# Altium project IntelligentJunctionBox_V1.PrjPcb
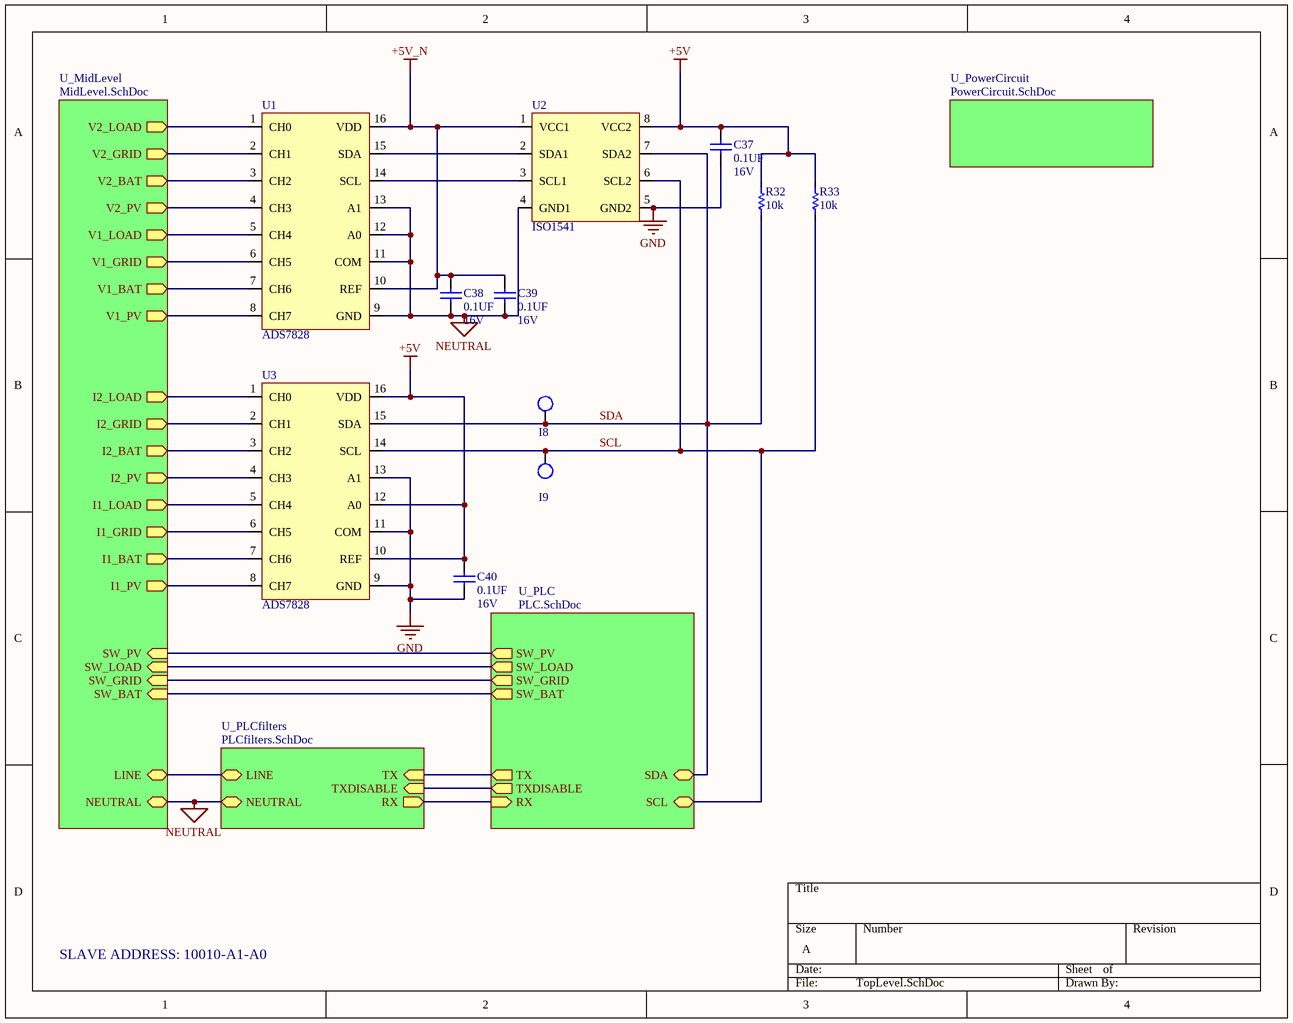
[diagram p0: TopLevel.SchDoc]
8 sheets, 283 parts. Net scope: hierarchical (ports join the sheet entries above them; power ports are global).
Board file: IntelligentJunctionBox_V1.PcbDoc
Sheets:
  TopLevel.SchDoc
    U_MidLevel = MidLevel.SchDoc
      PV1 = Isense.SchDoc
      B1 = Isense.SchDoc
      LD1 = Isense.SchDoc
      G1 = Isense.SchDoc
      LD2 = SSR.SchDoc
      PV2 = SSR.SchDoc
      B2 = SSR.SchDoc
      G2 = SSR.SchDoc
      PV3 = Vsense.SchDoc
      G3 = Vsense.SchDoc
      B3 = Vsense.SchDoc
      LD3 = Vsense.SchDoc
    U_PLCfilters = PLCfilters.SchDoc
    U_PLC = PLC.SchDoc
    U_PowerCircuit = PowerCircuit.SchDoc

## Sheet TopLevel.SchDoc
size A

### Parts
C37  Capacitance: 0.1UF  Voltage - Rated: 16V  [CAPC1608X08N]  (hidden comment: GRM188R71C104KA01D)
C38  Capacitance: 0.1UF  Voltage - Rated: 16V  [CAPC1608X08N]  (hidden comment: GRM188R71C104KA01D)
C39  Capacitance: 0.1UF  Voltage - Rated: 16V  [CAPC1608X08N]  (hidden comment: GRM188R71C104KA01D)
C40  Capacitance: 0.1UF  Voltage - Rated: 16V  [CAPC1608X08N]  (hidden comment: GRM188R71C104KA01D)
I8  Testpoint  [Testpoint]  (value not drawn)
I9  Testpoint  [Testpoint]  (value not drawn)
R32  Resistance: 10k  [RESC1608X06N]  (hidden comment: RC0603FR-0710KL)
R33  Resistance: 10k  [RESC1608X06N]  (hidden comment: RC0603FR-0710KL)
U1  ADS7828  [TSOP65P640X120-16N]
U2  ISO1541  [SOIC127P600X175-8N]
U3  ADS7828  [TSOP65P640X120-16N]

### Sub-sheets
U_MidLevel = MidLevel.SchDoc: V1_PV (out), V2_PV (out), I1_PV (out), I2_PV (out), SW_PV (in), V1_LOAD (out), V2_LOAD (out), I1_LOAD (out), I2_LOAD (out), SW_LOAD (in), V1_GRID (out), V2_GRID (out), I1_GRID (out), I2_GRID (out), SW_GRID (in), V1_BAT (out), V2_BAT (out), I1_BAT (out), I2_BAT (out), SW_BAT (in), NEUTRAL (bidir), LINE (bidir)
U_PLC = PLC.SchDoc: TX (out), RX (in), TXDISABLE (out), SCL (bidir), SDA (bidir), SW_PV (out), SW_LOAD (out), SW_GRID (out), SW_BAT (out)
U_PLCfilters = PLCfilters.SchDoc: RX (out), TX (in), TXDISABLE (in), LINE (bidir), NEUTRAL (bidir)
U_PowerCircuit = PowerCircuit.SchDoc: no entries

### Nets
+5V: C37.2 C40.2 R32.2 R33.2 U2.8(VCC2) U3.10(REF) U3.12(A0) U3.16(VDD)
+5V_N: C38.2 C39.2 U1.10(REF) U1.16(VDD) U2.1(VCC1)
GND: C37.1 C40.1 U2.5(GND2) U3.9(GND) U3.11(COM) U3.13(A1)
NEUTRAL: C38.1 C39.1 U1.9(GND) U1.11(COM) U1.12(A0) U1.13(A1) U2.4(GND1) ; sheet U_MidLevel/NEUTRAL, sheet U_PLCfilters/NEUTRAL
I1_BAT: U3.7(CH6) ; sheet U_MidLevel/I1_BAT
I1_GD: U3.6(CH5) ; sheet U_MidLevel/I1_GRID
I1_LD: U3.5(CH4) ; sheet U_MidLevel/I1_LOAD
I1_PV: U3.8(CH7) ; sheet U_MidLevel/I1_PV
I2_BAT: U3.3(CH2) ; sheet U_MidLevel/I2_BAT
I2_GD: U3.2(CH1) ; sheet U_MidLevel/I2_GRID
I2_LD: U3.1(CH0) ; sheet U_MidLevel/I2_LOAD
I2_PV: U3.4(CH3) ; sheet U_MidLevel/I2_PV
L1_BUS: sheet U_MidLevel/LINE, sheet U_PLCfilters/LINE
RX: sheet U_PLCfilters/RX, sheet U_PLC/RX
SCL: I9.1(TP) R33.1 U2.6(SCL2) U3.14(SCL) ; sheet U_PLC/SCL
SDA: I8.1(TP) R32.1 U2.7(SDA2) U3.15(SDA) ; sheet U_PLC/SDA
SW_BAT: sheet U_MidLevel/SW_BAT, sheet U_PLC/SW_BAT
SW_GD: sheet U_MidLevel/SW_GRID, sheet U_PLC/SW_GRID
SW_LD: sheet U_MidLevel/SW_LOAD, sheet U_PLC/SW_LOAD
SW_PV: sheet U_MidLevel/SW_PV, sheet U_PLC/SW_PV
TX: sheet U_PLCfilters/TX, sheet U_PLC/TX
TXDISABLE: sheet U_PLCfilters/TXDISABLE, sheet U_PLC/TXDISABLE
V1_BAT: U1.7(CH6) ; sheet U_MidLevel/V1_BAT
V1_GD: U1.6(CH5) ; sheet U_MidLevel/V1_GRID
V1_LD: U1.5(CH4) ; sheet U_MidLevel/V1_LOAD
V1_PV: U1.8(CH7) ; sheet U_MidLevel/V1_PV
V2_BAT: U1.3(CH2) ; sheet U_MidLevel/V2_BAT
V2_GD: U1.2(CH1) ; sheet U_MidLevel/V2_GRID
V2_LD: U1.1(CH0) ; sheet U_MidLevel/V2_LOAD
V2_PV: U1.4(CH3) ; sheet U_MidLevel/V2_PV
NetU1_14: U1.14(SCL) U2.3(SCL1)
NetU1_15: U1.15(SDA) U2.2(SDA1)

### Notes on the sheet
- SLAVE ADDRESS: 10010-A1-A0

### Library data of the parts
C37-C40 = GRM188R71C104KA01D: CAP CER 0.1UF 16V X7R 0603; Manufacturer: Murata Electronics North America; Manufacturer Part Number: GRM188R71C104KA01D; Supplier 1: Digi-Key; Supplier Part Number 1: 490-1532-1-ND
R32 R33 = RC0603FR-0710KL: RES SMD 10K OHM 1% 1/10W 0603; Manufacturer: Yageo; Manufacturer Part Number: RC0603FR-0710KL; Supplier 1: Digi-Key; Supplier Part Number 1: 311-10.0KHRCT-ND
U1 U3 = ADS7828: IC ADC 12BIT 50KSPS 8CH 16-TSSOP; Manufacturer: Texas Instruments; Manufacturer Part Number: ADS7828; Supplier 1: Digi-Key; Supplier Part Number 1: 296-38856-1-ND
U2 = ISO1541: DGTL ISO 2.5KV 2CH I2C 8SOIC; Manufacturer: Texas Instruments; Manufacturer Part Number: ISO1541; Supplier 1: Digi-Key; Supplier Part Number 1: 296-34895-5-ND

## Sheet MidLevel.SchDoc
size Letter
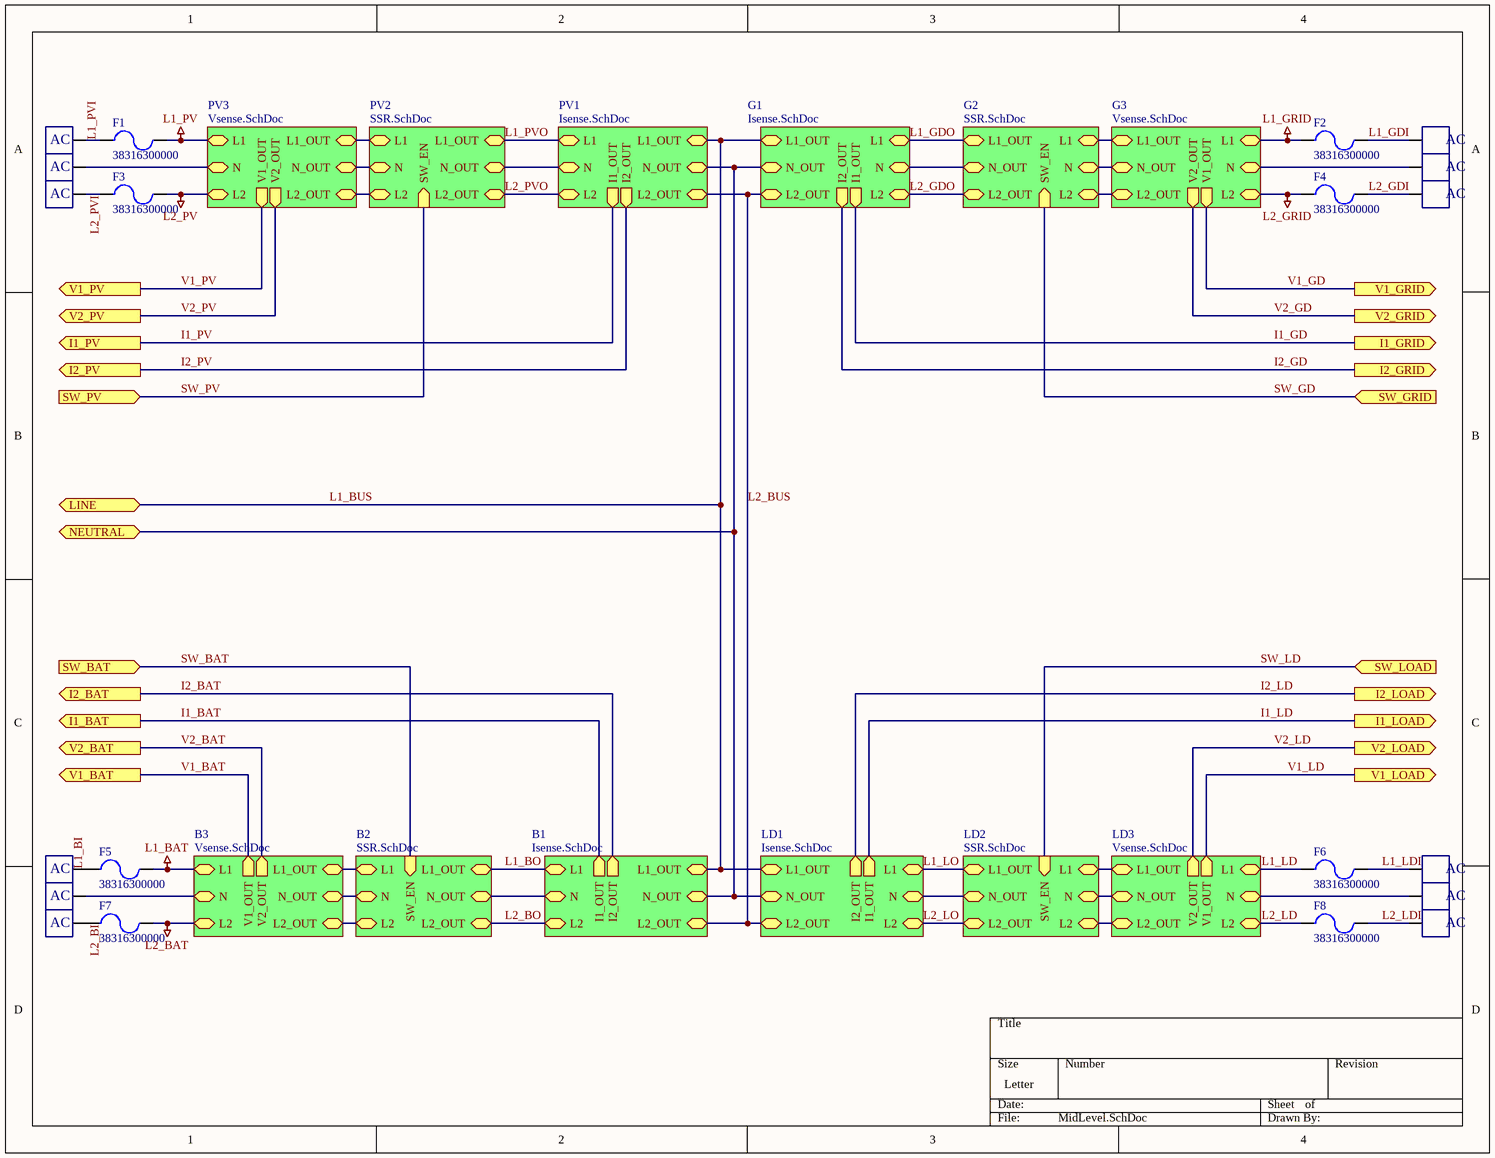
[diagram p1: MidLevel.SchDoc]

### Parts
F1  38316300000  [38316300000]
F2  38316300000  [38316300000]
F3  38316300000  [38316300000]
F4  38316300000  [38316300000]
F5  38316300000  [38316300000]
F6  38316300000  [38316300000]
F7  38316300000  [38316300000]
F8  38316300000  [38316300000]
J2  AC Connector_1  [AC_Connector_1]  (value not drawn)
J3  AC Connector_1  [AC_Connector_1]  (value not drawn)
J4  AC Connector_1  [AC_Connector_1]  (value not drawn)
J5  AC Connector_1  [AC_Connector_1]  (value not drawn)
J6  AC Connector_1  [AC_Connector_1]  (value not drawn)
J7  AC Connector_1  [AC_Connector_1]  (value not drawn)
J8  AC Connector_1  [AC_Connector_1]  (value not drawn)
J9  AC Connector_1  [AC_Connector_1]  (value not drawn)
J10  AC Connector_1  [AC_Connector_1]  (value not drawn)
J11  AC Connector_1  [AC_Connector_1]  (value not drawn)
J12  AC Connector_1  [AC_Connector_1]  (value not drawn)
J13  AC Connector_1  [AC_Connector_1]  (value not drawn)

### Sub-sheets
B1 = Isense.SchDoc: L1_OUT (bidir), L2_OUT (bidir), N_OUT (bidir), I1_OUT (out), I2_OUT (out), L1 (bidir), N (bidir), L2 (bidir)
B2 = SSR.SchDoc: SW_EN (in), L2_OUT (bidir), L2 (bidir), L1 (bidir), L1_OUT (bidir), N_OUT (bidir), N (bidir)
B3 = Vsense.SchDoc: L1 (bidir), L1_OUT (bidir), N (bidir), L2 (bidir), L2_OUT (bidir), N_OUT (bidir), V1_OUT (out), V2_OUT (out)
G1 = Isense.SchDoc: L1_OUT (bidir), L2_OUT (bidir), N_OUT (bidir), I1_OUT (out), I2_OUT (out), L1 (bidir), N (bidir), L2 (bidir)
G2 = SSR.SchDoc: SW_EN (in), N_OUT (bidir), L1_OUT (bidir), L2 (bidir), N (bidir), L1 (bidir), L2_OUT (bidir)
G3 = Vsense.SchDoc: L1 (bidir), L1_OUT (bidir), N (bidir), L2 (bidir), L2_OUT (bidir), N_OUT (bidir), V1_OUT (out), V2_OUT (out)
LD1 = Isense.SchDoc: L1_OUT (bidir), L2_OUT (bidir), N_OUT (bidir), I1_OUT (out), I2_OUT (out), L1 (bidir), N (bidir), L2 (bidir)
LD2 = SSR.SchDoc: SW_EN (in), L1_OUT (bidir), L2 (bidir), L2_OUT (bidir), L1 (bidir), N (bidir), N_OUT (bidir)
LD3 = Vsense.SchDoc: L1 (bidir), L1_OUT (bidir), N (bidir), L2 (bidir), L2_OUT (bidir), N_OUT (bidir), V1_OUT (out), V2_OUT (out)
PV1 = Isense.SchDoc: L1_OUT (bidir), L2_OUT (bidir), N_OUT (bidir), I1_OUT (out), I2_OUT (out), L1 (bidir), N (bidir), L2 (bidir)
PV2 = SSR.SchDoc: SW_EN (in), L2_OUT (bidir), N (bidir), N_OUT (bidir), L1 (bidir), L1_OUT (bidir), L2 (bidir)
PV3 = Vsense.SchDoc: L1 (bidir), L1_OUT (bidir), N (bidir), L2 (bidir), L2_OUT (bidir), N_OUT (bidir), V1_OUT (out), V2_OUT (out)

### Ports
I1_BAT (out), I1_GRID (out), I1_LOAD (out), I1_PV (out), I2_BAT (out), I2_GRID (out), I2_LOAD (out), I2_PV (out), LINE (bidir), NEUTRAL (bidir), SW_BAT (in), SW_GRID (in), SW_LOAD (in), SW_PV (in), V1_BAT (out), V1_GRID (out), V1_LOAD (out), V1_PV (out), V2_BAT (out), V2_GRID (out), V2_LOAD (out), V2_PV (out)

### Nets
L1_BAT: F5.2 ; sheet B2/L1, sheet B3/L1, sheet B3/L1_OUT
L1_GRID: F2.1 ; sheet G2/L1, sheet G3/L1, sheet G3/L1_OUT
L1_PV: F1.2 ; sheet PV2/L1, sheet PV3/L1, sheet PV3/L1_OUT
L2_BAT: F7.2 ; sheet B2/L2, sheet B3/L2, sheet B3/L2_OUT
L2_GRID: F4.1 ; sheet G2/L2, sheet G3/L2, sheet G3/L2_OUT
L2_PV: F3.2 ; sheet PV2/L2, sheet PV3/L2, sheet PV3/L2_OUT
NEUTRAL: J4.1 J5.1 J10.1 J11.1 ; port NEUTRAL, sheet PV1/N_OUT, sheet PV1/N, sheet B1/N_OUT, sheet B1/N, sheet LD1/N_OUT, sheet LD1/N, sheet G1/N_OUT, sheet G1/N, sheet LD2/N, sheet LD2/N_OUT, sheet PV2/N, sheet PV2/N_OUT, sheet B2/N_OUT, sheet B2/N, sheet G2/N_OUT, sheet G2/N, sheet PV3/N, sheet PV3/N_OUT, sheet G3/N, sheet G3/N_OUT, sheet B3/N, sheet B3/N_OUT, sheet LD3/N, sheet LD3/N_OUT
I1_BAT: port I1_BAT, sheet B1/I1_OUT
I1_GD: port I1_GRID, sheet G1/I1_OUT
I1_LD: port I1_LOAD, sheet LD1/I1_OUT
I1_PV: port I1_PV, sheet PV1/I1_OUT
I2_BAT: port I2_BAT, sheet B1/I2_OUT
I2_GD: port I2_GRID, sheet G1/I2_OUT
I2_LD: port I2_LOAD, sheet LD1/I2_OUT
I2_PV: port I2_PV, sheet PV1/I2_OUT
L1_BI: F5.1 J8.1
L1_BO: sheet B1/L1, sheet B2/L1_OUT
L1_BUS: port LINE, sheet PV1/L1_OUT, sheet B1/L1_OUT, sheet LD1/L1_OUT, sheet G1/L1_OUT
L1_GDI: F2.2 J3.1
L1_GDO: sheet G1/L1, sheet G2/L1_OUT
L1_LD: F6.1 ; sheet LD2/L1, sheet LD3/L1, sheet LD3/L1_OUT
L1_LDI: F6.2 J9.1
L1_LO: sheet LD1/L1, sheet LD2/L1_OUT
L1_PVI: F1.1 J2.1
L1_PVO: sheet PV1/L1, sheet PV2/L1_OUT
L2_BI: F7.1 J12.1
L2_BO: sheet B1/L2, sheet B2/L2_OUT
L2_BUS: sheet PV1/L2_OUT, sheet B1/L2_OUT, sheet LD1/L2_OUT, sheet G1/L2_OUT
L2_GDI: F4.2 J7.1
L2_GDO: sheet G1/L2, sheet G2/L2_OUT
L2_LD: F8.1 ; sheet LD2/L2, sheet LD3/L2, sheet LD3/L2_OUT
L2_LDI: F8.2 J13.1
L2_LO: sheet LD1/L2, sheet LD2/L2_OUT
L2_PVI: F3.1 J6.1
L2_PVO: sheet PV1/L2, sheet PV2/L2_OUT
SW_BAT: port SW_BAT, sheet B2/SW_EN
SW_GD: port SW_GRID, sheet G2/SW_EN
SW_LD: port SW_LOAD, sheet LD2/SW_EN
SW_PV: port SW_PV, sheet PV2/SW_EN
V1_BAT: port V1_BAT, sheet B3/V1_OUT
V1_GD: port V1_GRID, sheet G3/V1_OUT
V1_LD: port V1_LOAD, sheet LD3/V1_OUT
V1_PV: port V1_PV, sheet PV3/V1_OUT
V2_BAT: port V2_BAT, sheet B3/V2_OUT
V2_GD: port V2_GRID, sheet G3/V2_OUT
V2_LD: port V2_LOAD, sheet LD3/V2_OUT
V2_PV: port V2_PV, sheet PV3/V2_OUT

### Notes on the sheet
- (in symbol AC Connector_1) AC

### Library data of the parts
F1-F8 = 38316300000: FUSE BOARD MOUNT 6.3A 300VAC RAD; Manufacturer: Littelfuse Inc.; Manufacturer Part Number: 38316300000; Supplier 1: Digi-Key; Supplier Part Number 1: WK6301CT-ND
J2-J13 = AC Connector_1: AC Connector

## Sheet Isense.SchDoc
size A
Used 4 times, as channels U_MidLevel/PV1, U_MidLevel/B1, U_MidLevel/LD1, U_MidLevel/G1. Parts and nets are listed once, with the designators drawn on the sheet.
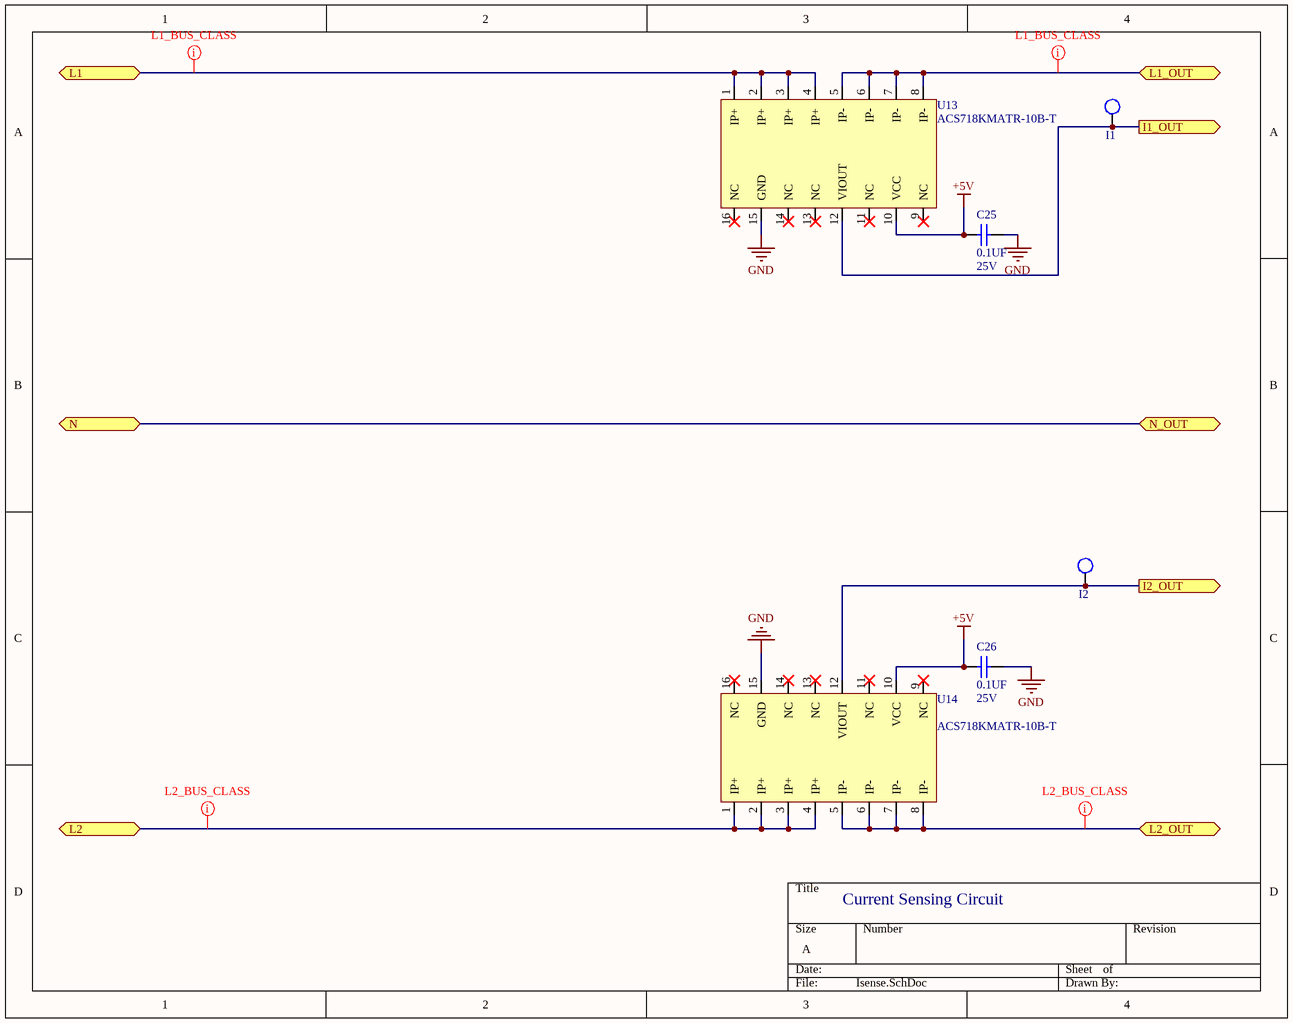
[diagram p2: Isense.SchDoc]

### Parts
C25  Capacitance: 0.1UF  Voltage - Rated: 25V  [CAPC3216X16N]  (hidden comment: GRM319R71E104KA01J)
C26  Capacitance: 0.1UF  Voltage - Rated: 25V  [CAPC3216X16N]  (hidden comment: GRM319R71E104KA01J)
I1  Testpoint  [Testpoint]  (value not drawn)
I2  Testpoint  [Testpoint]  (value not drawn)
U13  ACS718KMATR-10B-T  [SOIC127P1030X265-16N]
U14  ACS718KMATR-10B-T  [SOIC127P1030X265-16N]

### Ports
I1_OUT (out), I2_OUT (out), L1 (bidir), L1_OUT (bidir), L2 (bidir), L2_OUT (bidir), N (bidir), N_OUT (bidir)

### Nets
+5V: C25.1 C26.1 U13.10(VCC) U14.10(VCC)
GND: C25.2 C26.2 U13.15(GND) U14.15(GND)
I1_OUT: I1.1(TP) U13.12(VIOUT) ; port I1_OUT
I2_OUT: I2.1(TP) U14.12(VIOUT) ; port I2_OUT
L1: U13.1(IP+) U13.2(IP+) U13.3(IP+) U13.4(IP+) ; port L1
L1_OUT: U13.5(IP-) U13.6(IP-) U13.7(IP-) U13.8(IP-) ; port L1_OUT
L2: U14.1(IP+) U14.2(IP+) U14.3(IP+) U14.4(IP+) ; port L2
L2_OUT: U14.5(IP-) U14.6(IP-) U14.7(IP-) U14.8(IP-) ; port L2_OUT
N: port N, port N_OUT

Not connected (* = marked no-connect by the designer): U13 9(NC)* 11(NC)* 13(NC)* 14(NC)* 16(NC)*; U14 9(NC)* 11(NC)* 13(NC)* 14(NC)* 16(NC)*

### Channels
U_MidLevel/PV1: designators end in _PV1; ports I1_OUT=I1_PV I2_OUT=I2_PV L1=L1_PVO L1_OUT=L1_BUS L2=L2_PVO L2_OUT=L2_BUS N=NEUTRAL N_OUT=NEUTRAL
U_MidLevel/B1: designators end in _B1; ports I1_OUT=I1_BAT I2_OUT=I2_BAT L1=L1_BO L1_OUT=L1_BUS L2=L2_BO L2_OUT=L2_BUS N=NEUTRAL N_OUT=NEUTRAL
U_MidLevel/LD1: designators end in _LD1; ports I1_OUT=I1_LD I2_OUT=I2_LD L1=L1_LO L1_OUT=L1_BUS L2=L2_LO L2_OUT=L2_BUS N=NEUTRAL N_OUT=NEUTRAL
U_MidLevel/G1: designators end in _G1; ports I1_OUT=I1_GD I2_OUT=I2_GD L1=L1_GDO L1_OUT=L1_BUS L2=L2_GDO L2_OUT=L2_BUS N=NEUTRAL N_OUT=NEUTRAL

### Layout directives
net class L1_BUS_NETS: L1_BUS, L1_PVO
net class L2_BUS_NETS: L2_BUS, L2_PVO

### Notes on the sheet
- Current Sensing Circuit

### Library data of the parts
C25 C26 = GRM319R71E104KA01J: CAP CER 0.1UF 25V X7R 1206; Manufacturer: Murata Electronics North America; Manufacturer Part Number: GRM319R71E104KA01J; Supplier 1: Digi-Key; Supplier Part Number 1: 490-12564-1-ND
U13 U14 = ACS718KMATR-10B-T: SENSOR CURRENT HALL 10A AC/DC; Manufacturer: Allegro MicroSystems, LLC; Supplier 1: Digi-Key; Supplier Part Number 1: 620-1713-1-ND; Manufacturer Part Number: ACS718KMATR-10B-T

## Sheet SSR.SchDoc
size A
Used 4 times, as channels U_MidLevel/LD2, U_MidLevel/PV2, U_MidLevel/B2, U_MidLevel/G2. Parts and nets are listed once, with the designators drawn on the sheet.
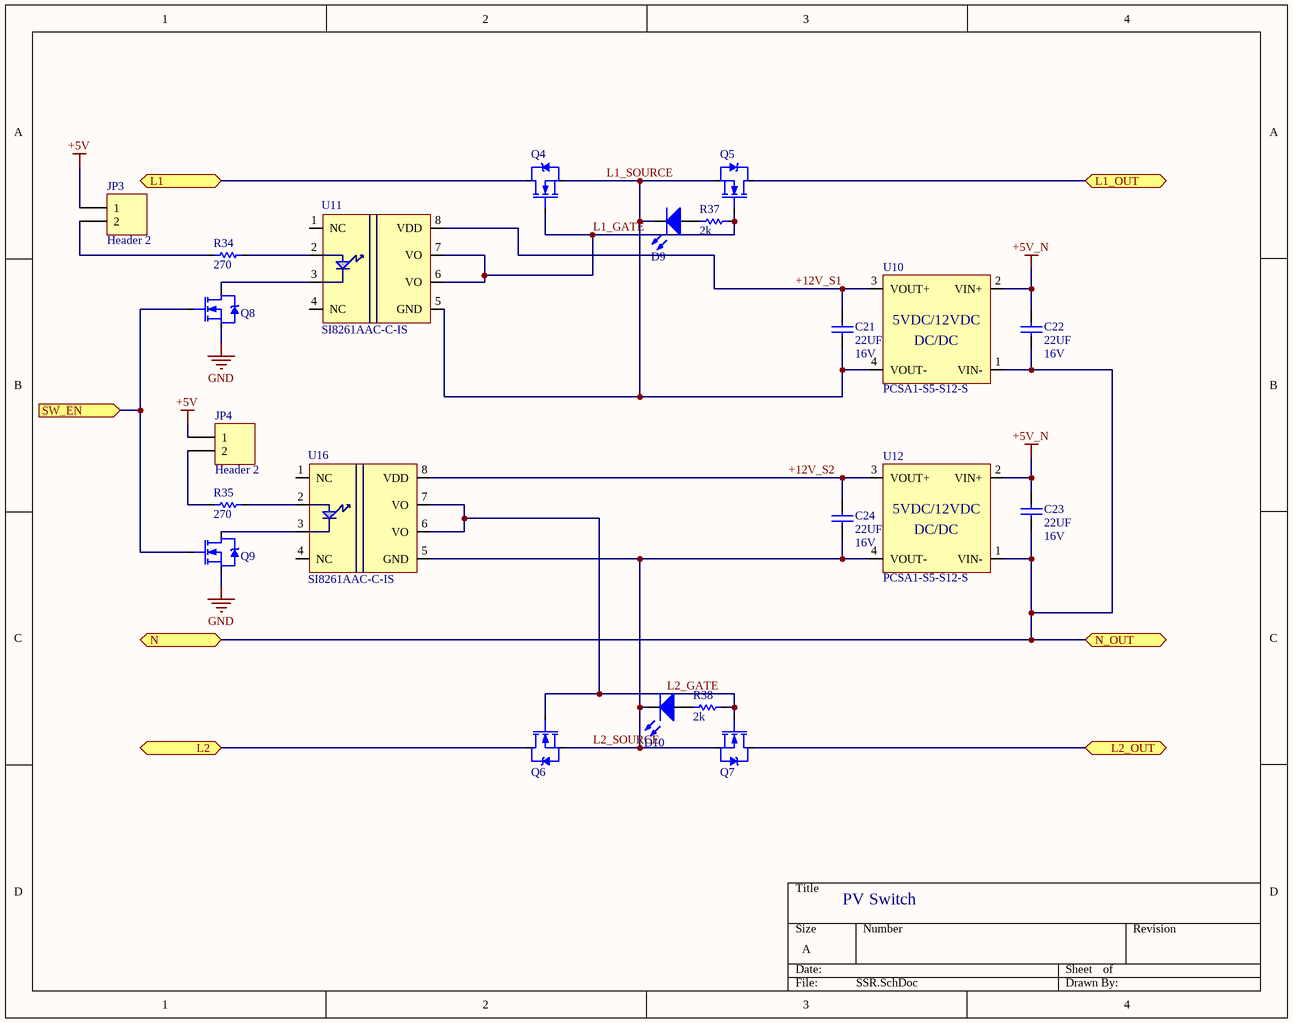
[diagram p3: SSR.SchDoc]

### Parts
C21  Capacitance: 22UF  Voltage - Rated: 16V  [CAPC3216X16N]  (hidden comment: GRM31CR61C226KE15K)
C22  Capacitance: 22UF  Voltage - Rated: 16V  [CAPC3216X16N]  (hidden comment: GRM31CR61C226KE15K)
C23  Capacitance: 22UF  Voltage - Rated: 16V  [CAPC3216X16N]  (hidden comment: GRM31CR61C226KE15K)
C24  Capacitance: 22UF  Voltage - Rated: 16V  [CAPC3216X16N]  (hidden comment: GRM31CR61C226KE15K)
D9  LTST-C190KGKT  [0603 LED]  (value not drawn)
D10  LTST-C190KGKT  [0603 LED]  (value not drawn)
JP3  Header 2  [HDR1X2]
JP4  Header 2  [HDR1X2]
Q4  STB42N60M2-EP  [D2PAK]  (value not drawn)
Q5  STB42N60M2-EP  [D2PAK]  (value not drawn)
Q6  STB42N60M2-EP  [D2PAK]  (value not drawn)
Q7  STB42N60M2-EP  [D2PAK]  (value not drawn)
Q8  NTR5103NT1G  [SOT95P237X111-3N]  (value not drawn)
Q9  NTR5103NT1G  [SOT95P237X111-3N]  (value not drawn)
R34  Resistance: 270  [RESC1608X06N]  (hidden comment: RC0603JR-07270RL)
R35  Resistance: 270  [RESC1608X06N]  (hidden comment: RC0603JR-07270RL)
R37  Resistance: 2k  [RESC1608X06N]  (hidden comment: RC0603FR-072KL)
R38  Resistance: 2k  [RESC1608X06N]  (hidden comment: RC0603FR-072KL)
U10  PCSA1-S5-S12-S  [PCSA1-S5-S12-S]
U11  SI8261AAC-C-IS  [SOIC-8]
U12  PCSA1-S5-S12-S  [PCSA1-S5-S12-S]
U16  SI8261AAC-C-IS  [SOIC-8]

### Ports
L1 (bidir), L1_OUT (bidir), L2 (bidir), L2_OUT (bidir), N (bidir), N_OUT (bidir), SW_EN (in)

### Nets
+5V: JP3.1 JP4.1
+5V_N: C22.2 C23.2 U10.2(VIN+) U12.2(VIN+)
GND: Q8.2(S) Q9.2(S)
+12V_S1: C21.2 U10.3(VOUT+) U11.8(VDD)
+12V_S2: C24.2 U12.3(VOUT+) U16.8(VDD)
L1: Q4.2(D) ; port L1
L1_GATE: Q4.1(G) Q5.1(G) R37.2 U11.6(VO) U11.7(VO)
L1_OUT: Q5.2(D) ; port L1_OUT
L1_SOURCE: C21.1 D9.2(K) Q4.3(S) Q5.3(S) U10.4(VOUT-) U11.5(GND)
L2: Q6.2(D) ; port L2
L2_GATE: Q6.1(G) Q7.1(G) R38.2 U16.6(VO) U16.7(VO)
L2_OUT: Q7.2(D) ; port L2_OUT
L2_SOURCE: C24.1 D10.2(K) Q6.3(S) Q7.3(S) U12.4(VOUT-) U16.5(GND)
N: C22.1 C23.1 U10.1(VIN-) U12.1(VIN-) ; port N, port N_OUT
SW_EN: Q8.1(G) Q9.1(G) ; port SW_EN
NetD9_1: D9.1(A) R37.1
NetD10_1: D10.1(A) R38.1
NetJP3_2: JP3.2 R34.1
NetJP4_2: JP4.2 R35.1
NetQ8_3: Q8.3(D) U11.3(K)
NetQ9_3: Q9.3(D) U16.3(K)
NetR34_2: R34.2 U11.2(A)
NetR35_2: R35.2 U16.2(A)

Not connected (* = marked no-connect by the designer): U11 1(NC) 4(NC); U16 1(NC) 4(NC)

### Channels
U_MidLevel/LD2: designators end in _LD2; ports L1=L1_LD L1_OUT=L1_LO L2=L2_LD L2_OUT=L2_LO N=NEUTRAL N_OUT=NEUTRAL SW_EN=SW_LD
U_MidLevel/PV2: designators end in _PV2; ports L1=L1_PV L1_OUT=L1_PVO L2=L2_PV L2_OUT=L2_PVO N=NEUTRAL N_OUT=NEUTRAL SW_EN=SW_PV
U_MidLevel/B2: designators end in _B2; ports L1=L1_BAT L1_OUT=L1_BO L2=L2_BAT L2_OUT=L2_BO N=NEUTRAL N_OUT=NEUTRAL SW_EN=SW_BAT
U_MidLevel/G2: designators end in _G2; ports L1=L1_GRID L1_OUT=L1_GDO L2=L2_GRID L2_OUT=L2_GDO N=NEUTRAL N_OUT=NEUTRAL SW_EN=SW_GD

### Notes on the sheet
- PV Switch
- (in symbol PCSA1-S5-S12-S) 5VDC/12VDC; DC/DC

### Library data of the parts
C21-C24 = GRM31CR61C226KE15K: CAP CER 22UF 16V X5R 1206; Manufacturer: Murata Electronics North America; Manufacturer Part Number: GRM31CR61C226KE15K; Supplier 1: Digi-Key; Supplier Part Number 1: 490-6512-1-ND
D9 D10 = LTST-C190KGKT: LED GREEN CLEAR 0603 SMD; Manufacturer: Lite-On Inc.; Manufacturer Part Number: LTST-C190KGKT; Supplier 1: Digi-Key; Supplier Part Number 1: 160-1435-1-ND
JP3 JP4 = Header 2: Header, 2-Pin; Manufacturer: Sullins Connector Solutions; Manufacturer Part Number: PBC36SAAN; Supplier 1: Digi-Key; Supplier Part Number 1: S1011E-36-ND
Q4-Q7 = STB42N60M2-EP: MOSFET N-CH 600V 34A EP D2PAK; Manufacturer: STMicroelectronics; Vdss(max): 600V; Manufacturer Part Number: STB42N60M2-EP; Supplier 1: Digi-Key; Supplier Part Number 1: 497-15896-1-ND
Q8 Q9 = NTR5103NT1G: MOSFET N-CH 60V 0.26A SOT23; Manufacturer: ON Semiconductor; Vdss(max): 60V; Manufacturer Part Number: NTR5103NT1G; Supplier 1: Digi-Key; Supplier Part Number 1: NTR5103NT1GOSCT-ND
R34 R35 = RC0603JR-07270RL: RES SMD 270 OHM 5% 1/10W 0603; Manufacturer: Yageo; Manufacturer Part Number: RC0603JR-07270RL; Supplier 1: Digi-Key; Supplier Part Number 1: 311-270GRCT-ND
R37 R38 = RC0603FR-072KL: RES SMD 2K OHM 1% 1/10W 0603; Manufacturer: Yageo; Manufacturer Part Number: RC0603FR-072KL; Supplier 1: Digi-Key; Supplier Part Number 1: 311-2.00KHRCT-ND
U10 U12 = PCSA1-S5-S12-S: DC/DC CONVERTER 5V-12V 1W; Manufacturer: CUI Inc.; Voltage - Input (Min): 4.5V; Voltage - Input (Max): 5.5V; Voltage - Output: 12V; Manufacturer Part Number: PCSA1-S5-S12-S; Power (Watts): 1W; Supplier 1: Digi-Key; Supplier Part Number 1: 102-3947-ND
U11 U16 = SI8261AAC-C-IS: DGTL ISO 3.75KV GATE DRVR 8SOIC; Manufacturer: Silicon Labs; Manufacturer Part Number: SI8261AAC-C-IS; Supplier 1: Digi-Key; Supplier Part Number 1: SI8261AAC-C-IS-ND

## Sheet Vsense.SchDoc
size A
Used 4 times, as channels U_MidLevel/PV3, U_MidLevel/G3, U_MidLevel/B3, U_MidLevel/LD3. Parts and nets are listed once, with the designators drawn on the sheet.
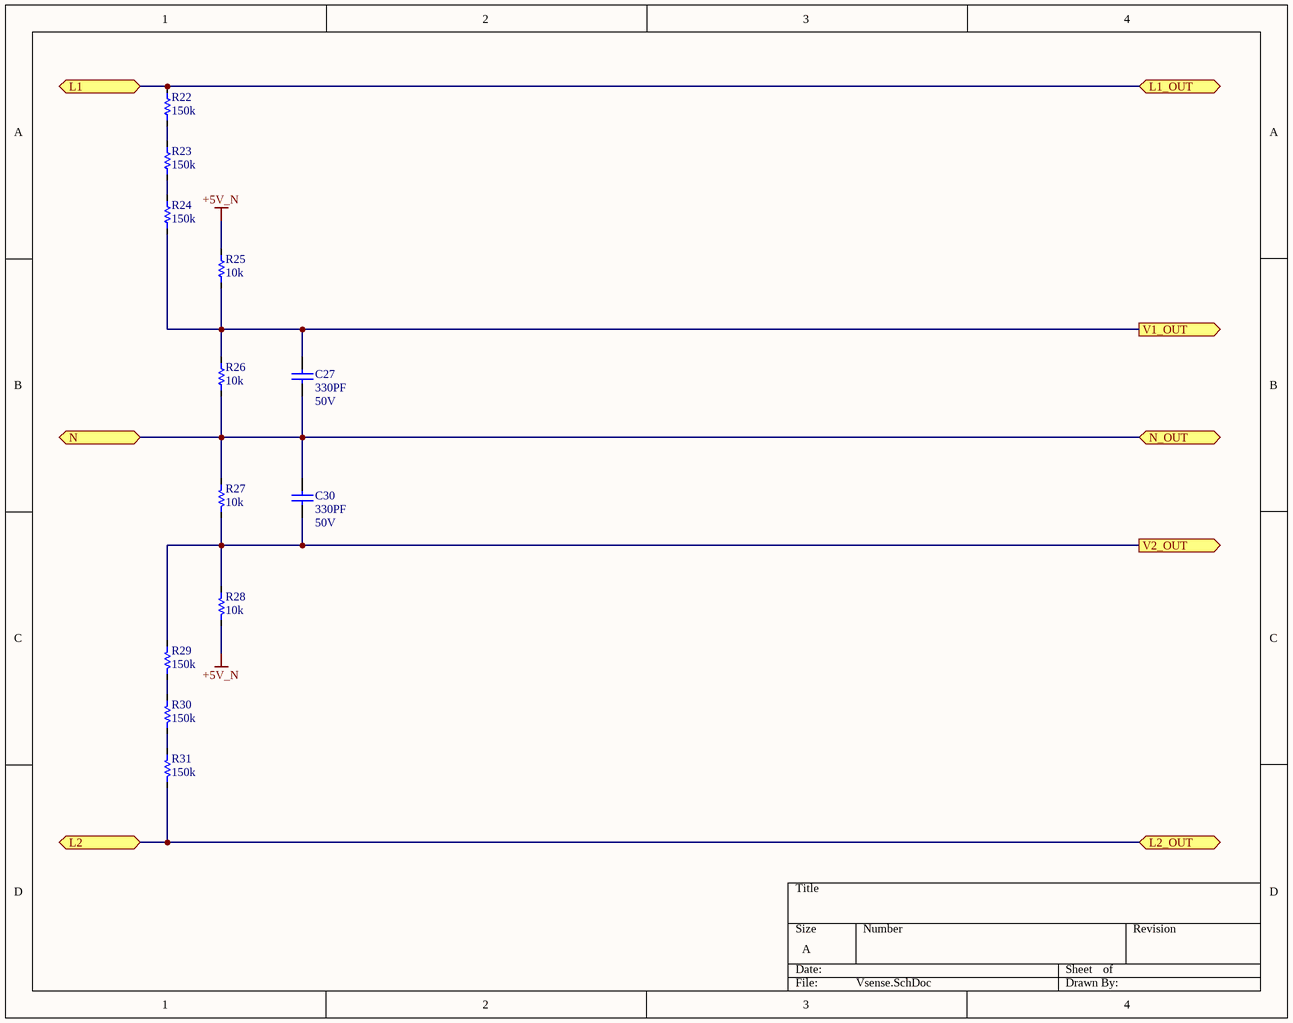
[diagram p4: Vsense.SchDoc]

### Parts
C27  Capacitance: 330PF  Voltage - Rated: 50V  [CAPC1608X08N]  (hidden comment: GRM188R71H331KA01D)
C30  Capacitance: 330PF  Voltage - Rated: 50V  [CAPC1608X08N]  (hidden comment: GRM188R71H331KA01D)
R22  Resistance: 150k  [RESC2012X06N]  (hidden comment: RC0805FR-07150KL)
R23  Resistance: 150k  [RESC2012X06N]  (hidden comment: RC0805FR-07150KL)
R24  Resistance: 150k  [RESC2012X06N]  (hidden comment: RC0805FR-07150KL)
R25  Resistance: 10k  [RESC1608X06N]  (hidden comment: RC0603FR-0710KL)
R26  Resistance: 10k  [RESC1608X06N]  (hidden comment: RC0603FR-0710KL)
R27  Resistance: 10k  [RESC1608X06N]  (hidden comment: RC0603FR-0710KL)
R28  Resistance: 10k  [RESC1608X06N]  (hidden comment: RC0603FR-0710KL)
R29  Resistance: 150k  [RESC2012X06N]  (hidden comment: RC0805FR-07150KL)
R30  Resistance: 150k  [RESC2012X06N]  (hidden comment: RC0805FR-07150KL)
R31  Resistance: 150k  [RESC2012X06N]  (hidden comment: RC0805FR-07150KL)

### Ports
L1 (bidir), L1_OUT (bidir), L2 (bidir), L2_OUT (bidir), N (bidir), N_OUT (bidir), V1_OUT (out), V2_OUT (out)

### Nets
+5V_N: R25.2 R28.2
L1: R22.2 ; port L1, port L1_OUT
L2: R31.2 ; port L2, port L2_OUT
N: C27.1 C30.2 R26.1 R27.1 ; port N, port N_OUT
V1_OUT: C27.2 R24.1 R25.1 R26.2 ; port V1_OUT
V2_OUT: C30.1 R27.2 R28.1 R29.1 ; port V2_OUT
NetR22_1: R22.1 R23.2
NetR23_1: R23.1 R24.2
NetR29_2: R29.2 R30.1
NetR30_2: R30.2 R31.1

### Channels
U_MidLevel/PV3: designators end in _PV3; ports L1=L1_PV L1_OUT=L1_PV L2=L2_PV L2_OUT=L2_PV N=NEUTRAL N_OUT=NEUTRAL V1_OUT=V1_PV V2_OUT=V2_PV
U_MidLevel/G3: designators end in _G3; ports L1=L1_GRID L1_OUT=L1_GRID L2=L2_GRID L2_OUT=L2_GRID N=NEUTRAL N_OUT=NEUTRAL V1_OUT=V1_GD V2_OUT=V2_GD
U_MidLevel/B3: designators end in _B3; ports L1=L1_BAT L1_OUT=L1_BAT L2=L2_BAT L2_OUT=L2_BAT N=NEUTRAL N_OUT=NEUTRAL V1_OUT=V1_BAT V2_OUT=V2_BAT
U_MidLevel/LD3: designators end in _LD3; ports L1=L1_LD L1_OUT=L1_LD L2=L2_LD L2_OUT=L2_LD N=NEUTRAL N_OUT=NEUTRAL V1_OUT=V1_LD V2_OUT=V2_LD

### Library data of the parts
C27 C30 = GRM188R71H331KA01D: CAP CER 330PF 50V X7R 0603; Manufacturer: Murata Electronics North America; Manufacturer Part Number: GRM188R71H331KA01D; Supplier 1: Digi-Key; Supplier Part Number 1: 490-1486-1-ND
R22-R24 R29-R31 = RC0805FR-07150KL: RES SMD 150K OHM 1% 1/8W 0805; Manufacturer: Yageo; Manufacturer Part Number: RC0805FR-07150KL; Supplier 1: Digi-Key; Supplier Part Number 1: 311-150KCRCT-ND
R25-R28 = RC0603FR-0710KL: as R32 on sheet TopLevel; Manufacturer Part Number: RC0603FR-0710KL; Supplier 1: Digi-Key; Supplier Part Number 1: 311-10.0KHRCT-ND

## Sheet PLCfilters.SchDoc
size B
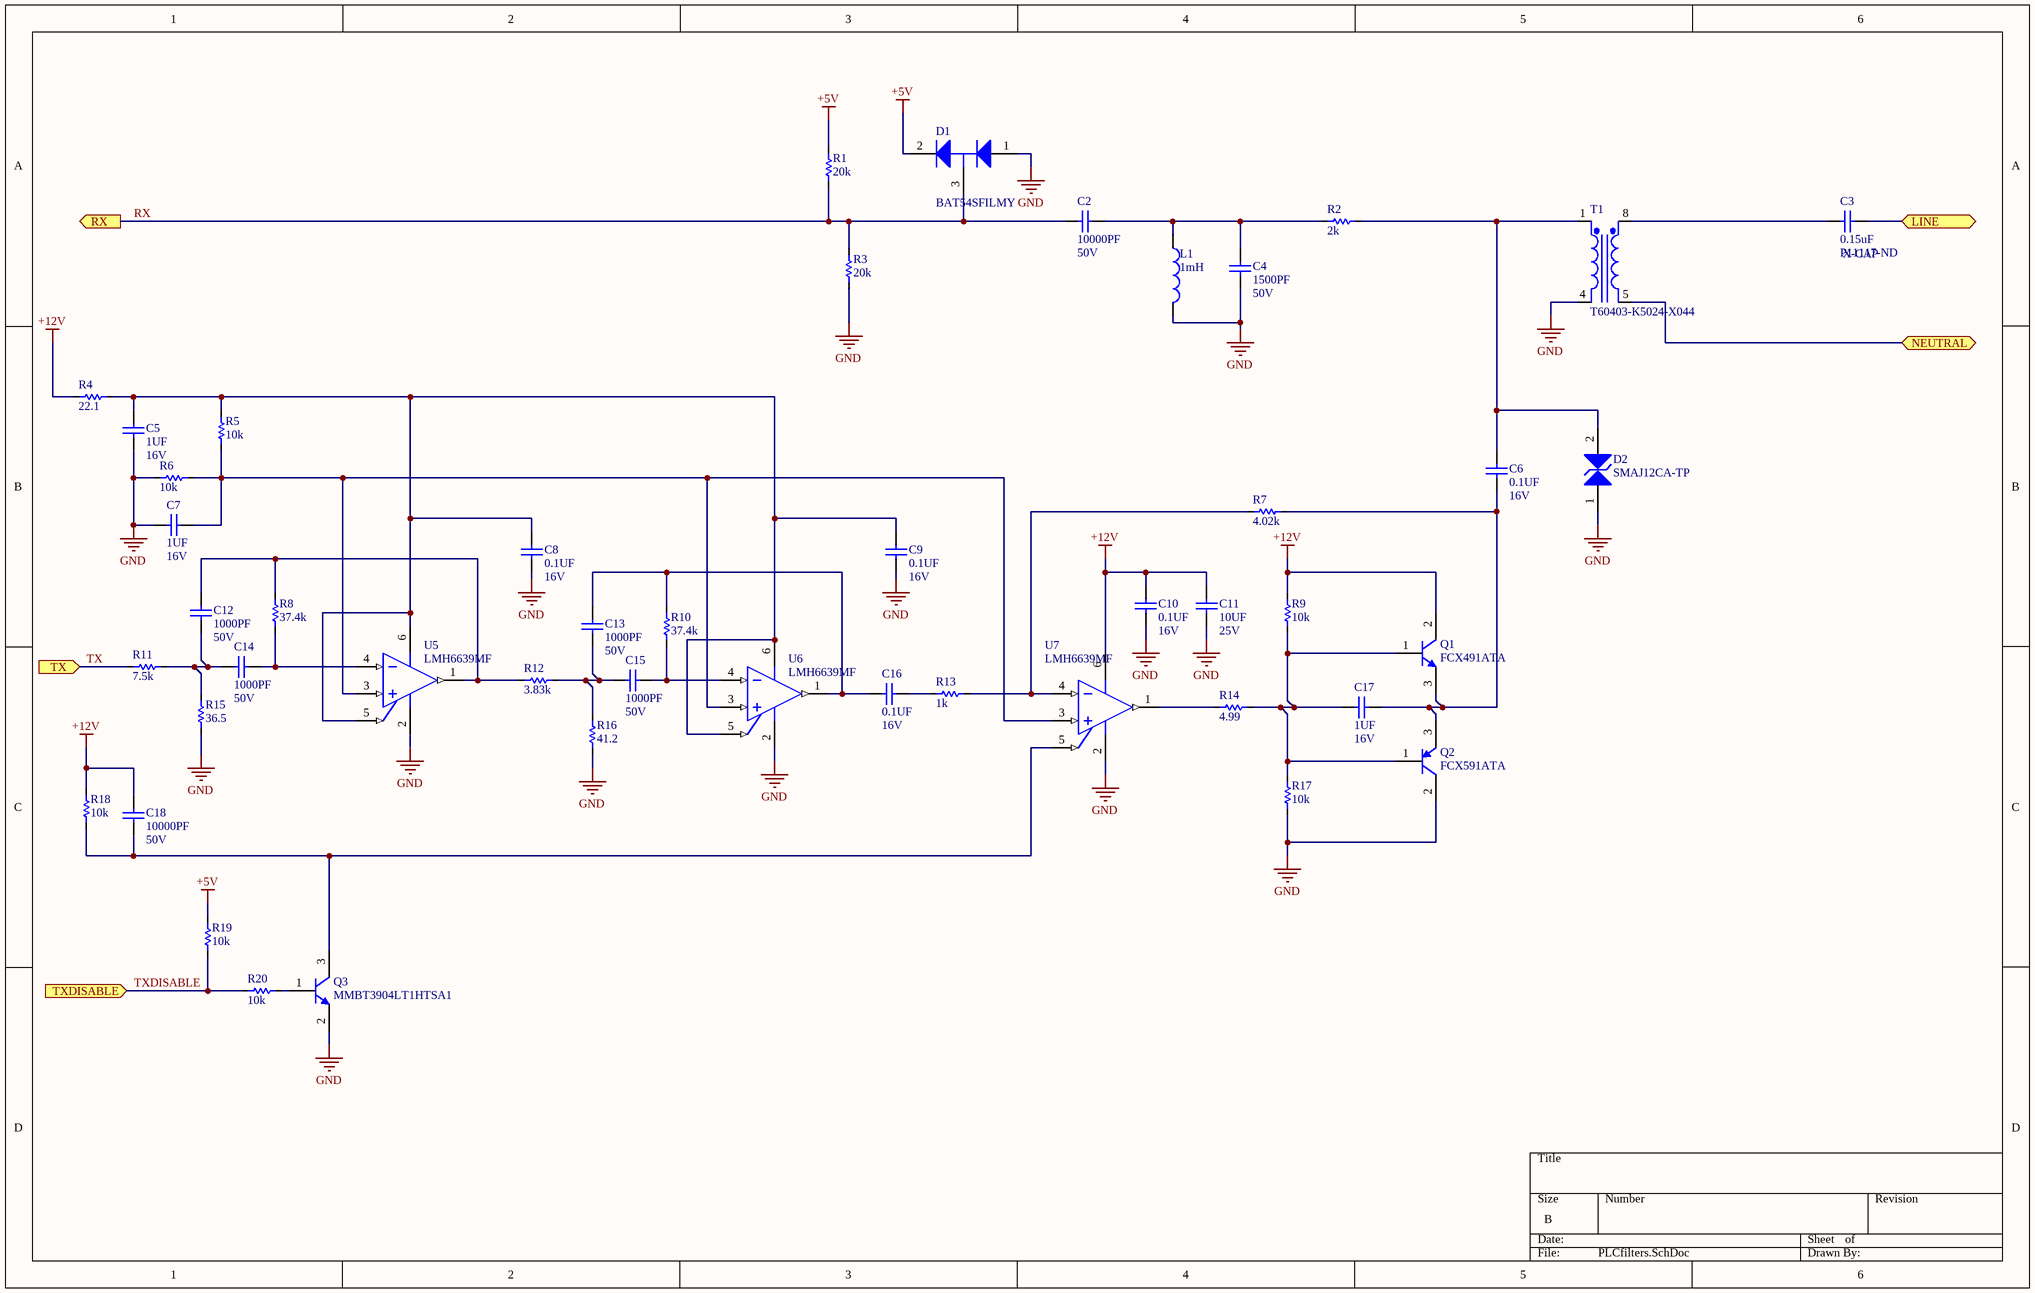
[diagram p5: PLCfilters.SchDoc]

### Parts
C2  Capacitance: 10000PF  Voltage - Rated: 50V  [CAPC1608X08N]  (hidden comment: GRM188R71H103KA01D)
C3  value 0.15uF  Supplier Part Number 1: P11117-ND  [ECQ-U3A154MG]  (hidden comment: ECQ-U3A154MG)
C4  Capacitance: 1500PF  Voltage - Rated: 50V  [CAPC1608X08N]  (hidden comment: GRM188R71H152KA01D)
C5  Capacitance: 1UF  Voltage - Rated: 16V  [CAPC1608X08N]  (hidden comment: GRM188R71C105KE15D)
C6  Capacitance: 0.1UF  Voltage - Rated: 16V  [CAPC1608X08N]  (hidden comment: GRM188R71C104KA01D)
C7  Capacitance: 1UF  Voltage - Rated: 16V  [CAPC1608X08N]  (hidden comment: GRM188R71C105KE15D)
C8  Capacitance: 0.1UF  Voltage - Rated: 16V  [CAPC1608X08N]  (hidden comment: GRM188R71C104KA01D)
C9  Capacitance: 0.1UF  Voltage - Rated: 16V  [CAPC1608X08N]  (hidden comment: GRM188R71C104KA01D)
C10  Capacitance: 0.1UF  Voltage - Rated: 16V  [CAPC1608X08N]  (hidden comment: GRM188R71C104KA01D)
C11  Capacitance: 10UF  Voltage - Rated: 25V  [CAPC3216X16N]  (hidden comment: GRM319R61E106KA12D)
C12  Capacitance: 1000PF  Voltage - Rated: 50V  [CAPC1608X08N]  (hidden comment: GRM1885C1H102JA01D)
C13  Capacitance: 1000PF  Voltage - Rated: 50V  [CAPC1608X08N]  (hidden comment: GRM1885C1H102JA01D)
C14  Capacitance: 1000PF  Voltage - Rated: 50V  [CAPC1608X08N]  (hidden comment: GRM1885C1H102JA01D)
C15  Capacitance: 1000PF  Voltage - Rated: 50V  [CAPC1608X08N]  (hidden comment: GRM1885C1H102JA01D)
C16  Capacitance: 0.1UF  Voltage - Rated: 16V  [CAPC1608X08N]  (hidden comment: GRM188R71C104KA01D)
C17  Capacitance: 1UF  Voltage - Rated: 16V  [CAPC1608X08N]  (hidden comment: GRM188R71C105KE15D)
C18  Capacitance: 10000PF  Voltage - Rated: 50V  [CAPC1608X08N]  (hidden comment: GRM188R71H103KA01D)
D1  BAT54SFILMY  [SOT95P240X110-3N]
D2  SMAJ12CA-TP  [DO-214AC]
L1  value 1mH  [INDC2518X20N]  (hidden comment: CB2518T102K)
Q1  FCX491ATA  [SOT89-150P409X160-3N]
Q2  FCX591ATA  [SOT89-150P409X160-3N]
Q3  MMBT3904LT1HTSA1  [SOT95P240X110-3N]
R1  Resistance: 20k  [RESC1608X06N]  (hidden comment: RC0603FR-0720KL)
R2  Resistance: 2k  [RESC1608X06N]  (hidden comment: RC0603FR-072KL)
R3  Resistance: 20k  [RESC1608X06N]  (hidden comment: RC0603FR-0720KL)
R4  Resistance: 22.1  [RESC1608X06N]  (hidden comment: RC0603FR-0722R1L)
R5  Resistance: 10k  [RESC1608X06N]  (hidden comment: RC0603FR-0710KL)
R6  Resistance: 10k  [RESC1608X06N]  (hidden comment: RC0603FR-0710KL)
R7  Resistance: 4.02k  [RESC1608X06N]  (hidden comment: RC0603FR-074K02L)
R8  Resistance: 37.4k  [RESC1608X06N]  (hidden comment: RC0603FR-0737K4L)
R9  Resistance: 10k  [RESC1608X06N]  (hidden comment: RC0603FR-0710KL)
R10  Resistance: 37.4k  [RESC1608X06N]  (hidden comment: RC0603FR-0737K4L)
R11  Resistance: 7.5k  [RESC1608X06N]  (hidden comment: AC0603FR-077K5L)
R12  Resistance: 3.83k  [RESC1608X06N]  (hidden comment: RC0603FR-073K83L)
R13  Resistance: 1k  [RESC1608X06N]  (hidden comment: RC0603FR-071KL)
R14  Resistance: 4.99  [RESC1608X06N]  (hidden comment: RC0603FR-074R99L)
R15  Resistance: 36.5  [RESC1608X06N]  (hidden comment: RC0603FR-0736R5L)
R16  Resistance: 41.2  [RESC1608X06N]  (hidden comment: RC0603FR-0741R2L)
R17  Resistance: 10k  [RESC1608X06N]  (hidden comment: RC0603FR-0710KL)
R18  Resistance: 10k  [RESC1608X06N]  (hidden comment: RC0603FR-0710KL)
R19  Resistance: 10k  [RESC1608X06N]  (hidden comment: RC0603FR-0710KL)
R20  Resistance: 10k  [RESC1608X06N]  (hidden comment: RC0603FR-0710KL)
T1  T60403-K5024-X044  [T60403-K5024-X044]
U5  LMH6639MF  [SOT95P280X145-6N]
U6  LMH6639MF  [SOT95P280X145-6N]
U7  LMH6639MF  [SOT95P280X145-6N]

### Ports
LINE (bidir), NEUTRAL (bidir), RX (out), TX (in), TXDISABLE (in)

### Nets
+5V: D1.2(K) R1.2 R19.2
+12V: C10.2 C11.2 C18.2 Q1.2(C) R4.1 R9.2 R18.2 U7.6(V+)
GND: C4.1 C5.1 C7.2 C8.1 C9.1 C10.1 C11.1 D1.1(A) D2.1(A) L1.2 Q2.2(C) Q3.2(E) R3.1 R6.1 R15.1 R16.1 R17.1 T1.4(Pri-) U5.2(V-) U6.2(V-) U7.2(V-)
NEUTRAL: T1.5(Sec-) ; port NEUTRAL
L1_BUS: C3.1 ; port LINE
RX: C2.2 D1.3(C) R1.1 R3.2 ; port RX
TX: R11.1 ; port TX
TXDISABLE: R19.1 R20.2 ; port TXDISABLE
NetC2_1: C2.1 C4.2 L1.1 R2.1
NetC3_2: C3.2 T1.8(Sec+)
NetC5_2: C5.2 C8.2 C9.2 R4.2 R5.2 U5.5(nSD) U5.6(V+) U6.5(nSD) U6.6(V+)
NetC6_1: C6.1 C17.2 Q1.3(E) Q2.3(E) R7.2
NetC6_2: C6.2 D2.2(K) R2.2 T1.1(Pri+)
NetC7_1: C7.1 R5.1 R6.2 U5.3(IN+) U6.3(IN+) U7.3(IN+)
NetC12_1: C12.1 C14.1 R11.2 R15.2
NetC12_2: C12.2 R8.2 R12.1 U5.1(OUT)
NetC13_1: C13.1 C15.1 R12.2 R16.2
NetC13_2: C13.2 C16.1 R10.2 U6.1(OUT)
NetC14_2: C14.2 R8.1 U5.4(IN-)
NetC15_2: C15.2 R10.1 U6.4(IN-)
NetC16_2: C16.2 R13.1
NetC17_1: C17.1 Q1.1(B) Q2.1(B) R9.1 R14.2 R17.2
NetC18_1: C18.1 Q3.3(C) R18.1 U7.5(nSD)
NetQ3_1: Q3.1(B) R20.1
NetR7_1: R7.1 R13.2 U7.4(IN-)
NetR14_1: R14.1 U7.1(OUT)

### Notes on the sheet
- (near C3) X-CAP

### Library data of the parts
C2 C18 = GRM188R71H103KA01D: CAP CER 10000PF 50V X7R 0603; Manufacturer: Murata Electronics North America; Manufacturer Part Number: GRM188R71H103KA01D; Supplier 1: Digi-Key; Supplier Part Number 1: 490-1512-1-ND
C3 = ECQ-U3A154MG: CAP FILM 0.15UF 20% 300VAC RAD; Manufacturer: Murata; Manufacturer Part Number: ECQ-U3A154MG; Supplier 1: Digi-Key
C4 = GRM188R71H152KA01D: CAP CER 1500PF 50V X7R 0603; Manufacturer: Murata Electronics North America; Manufacturer Part Number: GRM188R71H152KA01D; Supplier 1: Digi-Key; Supplier Part Number 1: 490-1498-1-ND
C5 C7 C17 = GRM188R71C105KE15D: CAP CER 1UF 16V X7R 0603; Manufacturer: Murata Electronics North America; Manufacturer Part Number: GRM188R71C105KE15D; Supplier 1: Digi-Key; Supplier Part Number 1: 490-10734-1-ND
C6 C8-C10 C16 = GRM188R71C104KA01D: as C37 on sheet TopLevel; Manufacturer Part Number: GRM188R71C104KA01D; Supplier 1: Digi-Key; Supplier Part Number 1: 490-1532-1-ND
C11 = GRM319R61E106KA12D: CAP CER 10UF 25V X5R 1206; Manufacturer: Murata Electronics North America; Manufacturer Part Number: GRM319R61E106KA12D; Supplier 1: Digi-Key; Supplier Part Number 1: 490-5525-1-ND
C12-C15 = GRM1885C1H102JA01D: CAP CER 1000PF 50V C0G/NP0 0603; Manufacturer: Murata Electronics North America; Manufacturer Part Number: GRM1885C1H102JA01D; Supplier 1: Digi-Key; Supplier Part Number 1: 490-1451-1-ND
D1 = BAT54SFILMY: DIODE ARRAY SCHOTTKY 40V SOT23-3; Manufacturer: STMicroelectronics; Manufacturer Part Number: BAT54SFILMY; Supplier 1: Digi-Key; Supplier Part Number 1: 497-12132-1-ND
D2 = SMAJ12CA-TP: TVS DIODE 12VWM 19.9VC SMA; Manufacturer: Micro Commercial Co; Manufacturer Part Number: SMAJ12CA-TP; Supplier 1: Digi-Key; Supplier Part Number 1: SMAJ12CA-TPMSCT-ND
L1 = CB2518T102K: FIXED IND 1MH 75MA 31.2 OHM SMD; Manufacturer: Taiyo Yuden; Manufacturer Part Number: CB2518T102K; Supplier 1: Digi-Key; Supplier Part Number 1: 587-2195-1-ND
Q1 = FCX491ATA: TRANS NPN 40V 1A SOT-89; Manufacturer: Diodes Incorporated; Manufacturer Part Number: FCX491ATA; Supplier 1: Digi-Key; Supplier Part Number 1: FCX491ACT-ND
Q2 = FCX591ATA: TRANS PNP 40V 1A SOT-89; Manufacturer: Diodes Incorporated; Manufacturer Part Number: FCX591ATA; Supplier 1: Digi-Key; Supplier Part Number 1: FCX591ACT-ND
Q3 = MMBT3904LT1HTSA1: TRANS NPN 40V 0.2A SOT-23; Manufacturer: Infineon Technologies; Manufacturer Part Number: MMBT3904LT1HTSA1; Supplier 1: Digi-Key; Supplier Part Number 1: MMBT3904LT1HTSA1CT-ND
R1 R3 = RC0603FR-0720KL: RES SMD 20K OHM 1% 1/10W 0603; Manufacturer: Yageo; Manufacturer Part Number: RC0603FR-0720KL; Supplier 1: Digi-Key; Supplier Part Number 1: 311-20.0KHRCT-ND
R2 = RC0603FR-072KL: as R37 on sheet SSR; Manufacturer Part Number: RC0603FR-072KL; Supplier 1: Digi-Key; Supplier Part Number 1: 311-2.00KHRCT-ND
R4 = RC0603FR-0722R1L: RES SMD 22.1 OHM 1% 1/10W 0603; Manufacturer: Yageo; Manufacturer Part Number: RC0603FR-0722R1L; Supplier 1: Digi-Key; Supplier Part Number 1: 311-22.1HRCT-ND
R5 R6 R9 R17-R20 = RC0603FR-0710KL: as R32 on sheet TopLevel; Manufacturer Part Number: RC0603FR-0710KL; Supplier 1: Digi-Key; Supplier Part Number 1: 311-10.0KHRCT-ND
R7 = RC0603FR-074K02L: RES SMD 4.02K OHM 1% 1/10W 0603; Manufacturer: Yageo; Manufacturer Part Number: RC0603FR-074K02L; Supplier 1: Digi-Key; Supplier Part Number 1: 311-4.02KHRCT-ND
R8 R10 = RC0603FR-0737K4L: RES SMD 37.4K OHM 1% 1/10W 0603; Manufacturer: Yageo; Manufacturer Part Number: RC0603FR-0737K4L; Supplier 1: Digi-Key; Supplier Part Number 1: 311-37.4KHRCT-ND
R11 = AC0603FR-077K5L: RES SMD 7.5K OHM 1% 1/10W 0603; Manufacturer: Yageo; Manufacturer Part Number: AC0603FR-077K5L; Supplier 1: Digi-Key; Supplier Part Number 1: 311-36.5HRCT-ND
R12 = RC0603FR-073K83L: RES SMD 3.83K OHM 1% 1/10W 0603; Manufacturer: Yageo; Manufacturer Part Number: RC0603FR-073K83L; Supplier 1: Digi-Key; Supplier Part Number 1: 311-3.83KHRCT-ND
R13 = RC0603FR-071KL: RES SMD 1K OHM 1% 1/10W 0603; Manufacturer: Yageo; Manufacturer Part Number: RC0603FR-0710K7L; Supplier 1: Digi-Key; Supplier Part Number 1: 311-1.00KHRCT-ND
R14 = RC0603FR-074R99L: RES SMD 4.99 OHM 1% 1/10W 0603; Manufacturer: Yageo; Manufacturer Part Number: RC0603FR-074R99L; Supplier 1: Digi-Key; Supplier Part Number 1: 311-4.99HRCT-ND
R15 = RC0603FR-0736R5L: RES SMD 36.5 OHM 1% 1/10W 0603; Manufacturer: Yageo; Manufacturer Part Number: RC0603FR-0736R5L; Supplier 1: Digi-Key; Supplier Part Number 1: 311-36.5HRCT-ND
R16 = RC0603FR-0741R2L: RES SMD 41.2 OHM 1% 1/10W 0603; Manufacturer: Yageo; Manufacturer Part Number: RC0603FR-0741R2L; Supplier 1: Digi-Key; Supplier Part Number 1: 311-41.2HRCT-ND
T1 = T60403-K5024-X044: Audio Transformers / Signal Transformers PLC Transf PTH SMD 1.4mH 1:1; Manufacturer: Vacuumschmelze; Manufacturer Part Number: T60403-K5024-X044; Supplier 1: Mouser; Supplier Part Number 1: 983-T60403-K5024X044
U5-U7 = LMH6639MF: IC OPAMP VFB 90MHZ RRO SOT23-6; Manufacturer: Texas Instruments; Manufacturer Part Number: LMH6639MF; Supplier 1: Digi-Key; Supplier Part Number 1: LMH6639MFCT-ND

## Sheet PLC.SchDoc
size A
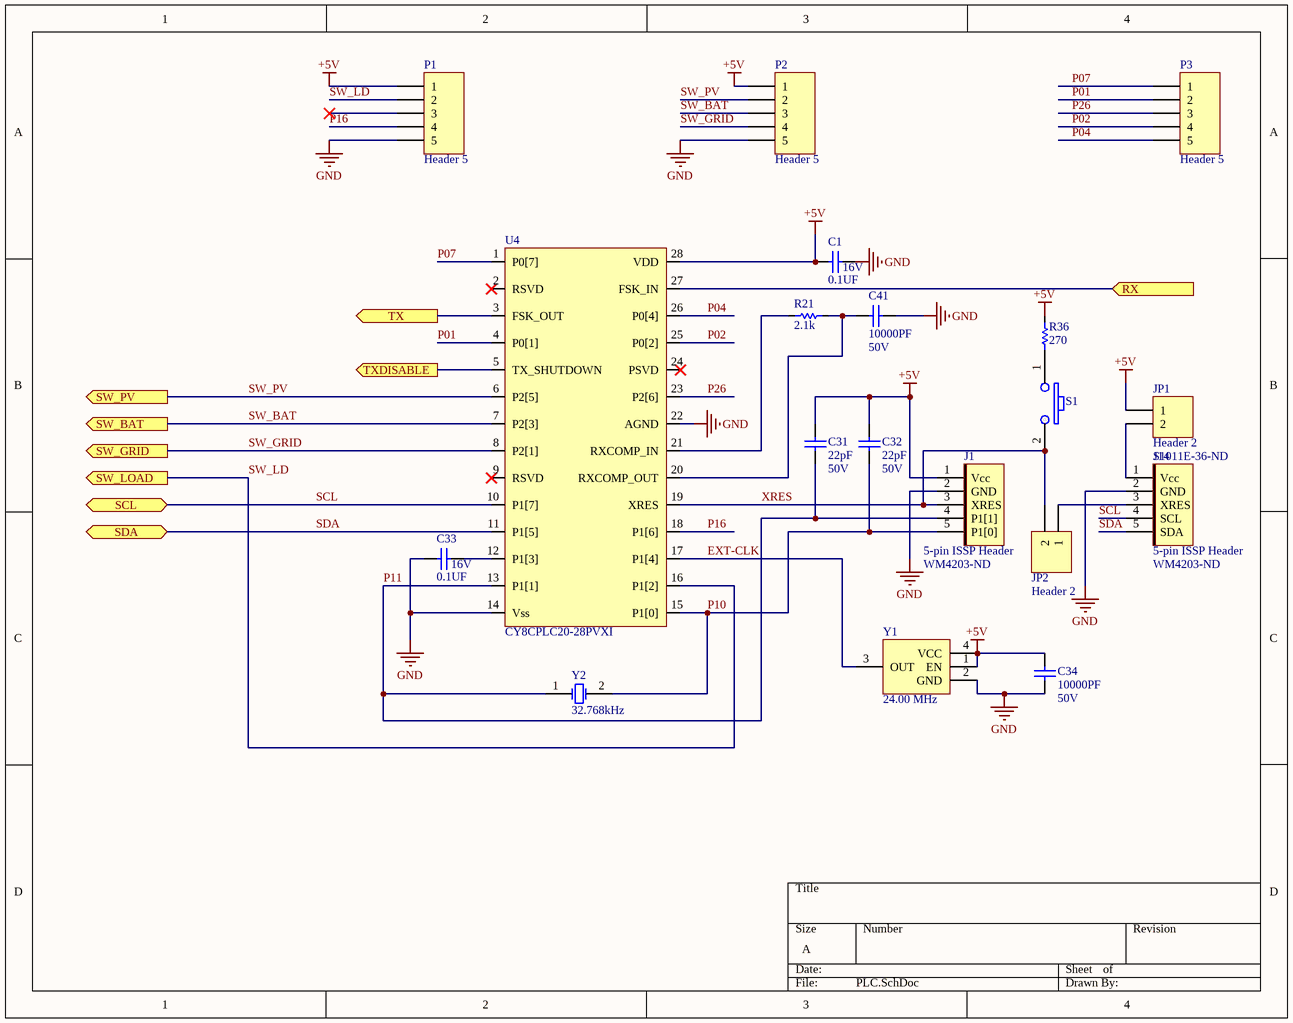
[diagram p6: PLC.SchDoc]

### Parts
C1  Capacitance: 0.1UF  Voltage - Rated: 16V  [CAPC1608X08N]  (hidden comment: GRM188R71C104KA01D)
C31  Capacitance: 22pF  Voltage - Rated: 50V  [CAPC1608X08N]  (hidden comment: GRM1885C1H220JA01D)
C32  Capacitance: 22pF  Voltage - Rated: 50V  [CAPC1608X08N]  (hidden comment: GRM1885C1H220JA01D)
C33  Capacitance: 0.1UF  Voltage - Rated: 16V  [CAPC1608X08N]  (hidden comment: GRM188R71C104KA01D)
C34  Capacitance: 10000PF  Voltage - Rated: 50V  [CAPC1608X08N]  (hidden comment: GRM188R71H103KA01D)
C41  Capacitance: 10000PF  Voltage - Rated: 50V  [CAPC1608X08N]  (hidden comment: GRM188R71H103KA01D)
J1  5-pin ISSP Header  Supplier Part Number 1: WM4203-ND  [ISPCON]
J14  5-pin ISSP Header  Supplier Part Number 1: WM4203-ND  [ISPCON]
JP1  Header 2  Supplier Part Number 1: S1011E-36-ND  [HDR1X2]
JP2  Header 2  [HDR1X2]
P1  Header 5  [HDR1X5]
P2  Header 5  [HDR1X5]
P3  Header 5  [HDR1X5]
R21  Resistance: 2.1k  [RESC1608X06N]  (hidden comment: RC0603FR-072K1L)
R36  Resistance: 270  [RESC1608X06N]  (hidden comment: RC0603JR-07270RL)
S1  B3F-1022  [STDSW]  (value not drawn)
U4  CY8CPLC20-28PVXI  [SOP65P780X200-28N]
Y1  value 24.00 MHz  [CSX-750F]  (hidden comment: CSX-750FCC24000000T)
Y2  32.768kHz  [XTAL32K]

### Ports
RX (in), SCL (bidir), SDA (bidir), SW_BAT (out), SW_GRID (out), SW_LOAD (out), SW_PV (out), TX (out), TXDISABLE (out)

### Nets
+5V: C1.1 C31.2 C32.2 C34.2 J1.1(Vcc) JP1.1 P1.1 P2.1 R36.2 U4.28(VDD) Y1.1(EN) Y1.4(VCC)
GND: C1.2 C33.1 C34.1 C41.1 J1.2(GND) J14.2(GND) P1.5 P2.5 U4.14(Vss) U4.22(AGND) Y1.2(GND)
EXT-CLK: U4.17(P1[4]) Y1.3(OUT)
P01: P3.2 U4.4(P0[1])
P02: P3.4 U4.25(P0[2])
P04: P3.5 U4.26(P0[4])
P07: P3.1 U4.1(P0[7])
P10: C32.1 J1.5(P1[0]) U4.15(P1[0]) Y2.2(OSC2)
P11: C31.1 J1.4(P1[1]) U4.13(P1[1]) Y2.1(OSC1)
P16: P1.4 U4.18(P1[6])
P26: P3.3 U4.23(P2[6])
RX: U4.27(FSK_IN) ; port RX
SCL: J14.4(SCL) U4.10(P1[7]) ; port SCL
SDA: J14.5(SDA) U4.11(P1[5]) ; port SDA
SW_BAT: P2.3 U4.7(P2[3]) ; port SW_BAT
SW_GRID: P2.4 U4.8(P2[1]) ; port SW_GRID  [project net SW_GD]
SW_LD: P1.2 U4.16(P1[2]) ; port SW_LOAD
SW_PV: P2.2 U4.6(P2[5]) ; port SW_PV
TX: U4.3(FSK_OUT) ; port TX
TXDISABLE: U4.5(TX_SHUTDOWN) ; port TXDISABLE
XRES: J1.3(XRES) JP2.2 S1.2(NO) U4.19(XRES)
NetC33_2: C33.2 U4.12(P1[3])
NetC41_2: C41.2 R21.2 U4.20(RXCOMP_OUT)
NetJ14_1: J14.1(Vcc) JP1.2
NetJ14_3: J14.3(XRES) JP2.1
NetR21_1: R21.1 U4.21(RXCOMP_IN)
NetR36_1: R36.1 S1.1(C)

Not connected (* = marked no-connect by the designer): P1 3*; U4 2(RSVD)* 9(RSVD)* 24(PSVD)*

### Library data of the parts
C1 C33 = GRM188R71C104KA01D: as C37 on sheet TopLevel; Manufacturer Part Number: GRM188R71C104KA01D; Supplier 1: Digi-Key; Supplier Part Number 1: 490-1532-1-ND
C31 C32 = GRM1885C1H220JA01D: CAP CER 22PF 50V C0G/NP0 0603; Manufacturer: Murata Electronics North America; Manufacturer Part Number: GRM1885C1H220JA01D; Supplier 1: Digi-Key; Supplier Part Number 1: 490-1411-1-ND
C34 C41 = GRM188R71H103KA01D: as C2 on sheet PLCfilters; Manufacturer Part Number: GRM188R71H103KA01D; Supplier 1: Digi-Key; Supplier Part Number 1: 490-1512-1-ND
J1 = ISSP_CON: CONN HEADER 5POS .100 VERT TIN; Manufacturer: Molex; Manufacturer Part Number: 22-23-2051; Supplier 1: Digi-Key
J14 = I2C_Connector: CONN HEADER 5POS .100 VERT TIN; Manufacturer: Molex; Manufacturer Part Number: 22-23-2051; Supplier 1: Digi-Key
JP1 JP2 = Header 2: as JP3 on sheet SSR; Supplier 1: Digi-Key
  JP2: Supplier Part Number 1: S1011E-36-ND
P1-P3 = Header 5: Header, 5-Pin; Manufacturer Part Number: PBC36SAAN; Manufacturer: Sullins Connector Solutions; Supplier 1: Digi-Key; Supplier Part Number 1: S1011E-36-ND
R21 = RC0603FR-072K1L: RES SMD 2.1K OHM 1% 1/10W 0603; Manufacturer: Yageo; Manufacturer Part Number: RC0603FR-072K1L; Supplier 1: Digi-Key; Supplier Part Number 1: 311-2.10KHRCT-ND
R36 = RC0603JR-07270RL: as R34 on sheet SSR; Manufacturer Part Number: RC0603JR-07270RL; Supplier 1: Digi-Key; Supplier Part Number 1: 311-270GRCT-ND
S1 = SPST: Swtich, SPST; Manufacturer: Omron; Manufacturer Part Number: B3F-1022; Supplier 1: Digi-Key; Supplier Part Number 1: SW403-ND
U4 = CY8CPLC20-28PVXI: IC PLC PSOC CMOS 28SSOP; Manufacturer: Cypress Semiconductor Corp; Manufacturer Part Number: CY8CPLC20-28PVXI; Supplier 1: Digi-Key; Supplier Part Number 1: CY8CPLC20-28PVXI-ND
Y1 = CSX-750FCC24000000T: OSC XO 24.000MHZ CMOS TTL SMD; Manufacturer: Citizen Finedevice Co Ltd; Manufacturer Part Number: CSX-750FCC24000000T; Supplier 1: Digi-Key; Supplier Part Number 1: 300-7214-1-ND
Y2 = XTAL: Crystal 32.768kHz 12.5pF; Manufacturer: ECS Inc.; Manufacturer Part Number: ECS-3X8X; Value: 32.768kHz; Supplier 1: Digi-Key; Supplier Part Number 1: X1123-ND

## Sheet PowerCircuit.SchDoc
size A
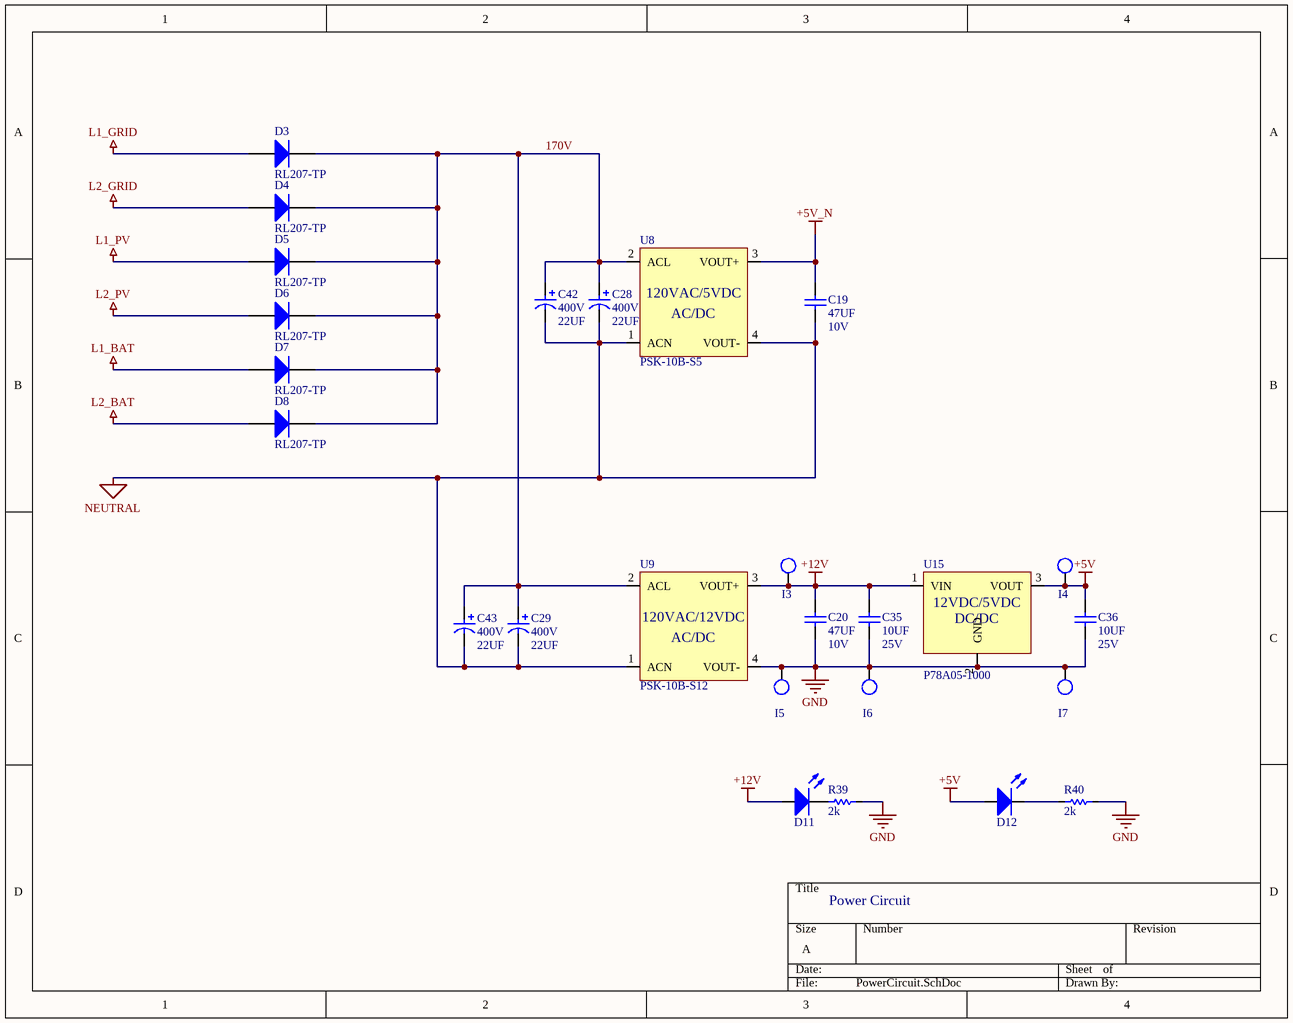
[diagram p7: PowerCircuit.SchDoc]

### Parts
C19  Capacitance: 47UF  Voltage - Rated: 10V  [CAPC3216X16N]  (hidden comment: GRM31CR61A476ME15L)
C20  Capacitance: 47UF  Voltage - Rated: 10V  [CAPC3216X16N]  (hidden comment: GRM31CR61A476ME15L)
C28  value 22UF  Voltage: 400V  [Radial-5mm]  (hidden comment: UCS2G220MHD)
C29  value 22UF  Voltage: 400V  [Radial-5mm]  (hidden comment: UCS2G220MHD)
C35  Capacitance: 10UF  Voltage - Rated: 25V  [CAPC3216X16N]  (hidden comment: GRM319R61E106KA12D)
C36  Capacitance: 10UF  Voltage - Rated: 25V  [CAPC3216X16N]  (hidden comment: GRM319R61E106KA12D)
C42  value 22UF  Voltage: 400V  [Radial-5mm]  (hidden comment: UCS2G220MHD)
C43  value 22UF  Voltage: 400V  [Radial-5mm]  (hidden comment: UCS2G220MHD)
D3  RL207-TP  [DO-204AL]
D4  RL207-TP  [DO-204AL]
D5  RL207-TP  [DO-204AL]
D6  RL207-TP  [DO-204AL]
D7  RL207-TP  [DO-204AL]
D8  RL207-TP  [DO-204AL]
D11  LTST-C190KGKT  [0603 LED]  (value not drawn)
D12  LTST-C190KGKT  [0603 LED]  (value not drawn)
I3  Testpoint  [Testpoint]  (value not drawn)
I4  Testpoint  [Testpoint]  (value not drawn)
I5  Testpoint  [Testpoint]  (value not drawn)
I6  Testpoint  [Testpoint]  (value not drawn)
I7  Testpoint  [Testpoint]  (value not drawn)
R39  Resistance: 2k  [RESC1608X06N]  (hidden comment: RC0603FR-072KL)
R40  Resistance: 2k  [RESC1608X06N]  (hidden comment: RC0603FR-072KL)
U8  PSK-10B-S5  [PSK-10B-S5]
U9  PSK-10B-S12  [PSK-10B-S5]
U15  P78A05-1000  [P78A05-1000]

### Nets
+5V: C36.2 D12.1(A) I4.1(TP) U15.3(VOUT)
+5V_N: C19.2 U8.3(VOUT+)
+12V: C20.2 C35.2 D11.1(A) I3.1(TP) U9.3(VOUT+) U15.1(VIN)
GND: C20.1 C35.1 C36.1 I5.1(TP) I6.1(TP) I7.1(TP) R39.2 R40.2 U9.4(VOUT-) U15.2(GND)
L1_BAT: D7.1(A)
L1_GRID: D3.1(A)
L1_PV: D5.1(A)
L2_BAT: D8.1(A)
L2_GRID: D4.1(A)
L2_PV: D6.1(A)
NEUTRAL: C19.1 C28.2 C29.2 C42.2 C43.2 U8.1(ACN) U8.4(VOUT-) U9.1(ACN)
170V: C28.1 C29.1 C42.1 C43.1 D3.2(K) D4.2(K) D5.2(K) D6.2(K) D7.2(K) D8.2(K) U8.2(ACL) U9.2(ACL)
NetD11_2: D11.2(K) R39.1
NetD12_2: D12.2(K) R40.1

### Notes on the sheet
- Power Circuit
- (in symbol P78A05-1000) 12VDC/5VDC; DC/DC
- (in symbol PSK-10B-S5) 120VAC/5VDC; AC/DC
- (in symbol PSK-10B-S12) 120VAC/12VDC; AC/DC

### Library data of the parts
C19 C20 = GRM31CR61A476ME15L: CAP CER 47UF 10V X5R 1206; Manufacturer: Murata Electronics North America; Manufacturer Part Number: GRM31CR61A476ME15L; Supplier 1: Digi-Key; Supplier Part Number 1: 490-5528-1-ND
C28 C29 C42 C43 = UCS2G220MHD: CAP ALUM 22UF 20% 400V RADIAL; Manufacturer: Nichicon; Manufacturer Part Number: UCS2G220MHD; Supplier 1: Digi-Key; Supplier Part Number 1: 493-5875-ND
C35 C36 = GRM319R61E106KA12D: as C11 on sheet PLCfilters; Manufacturer Part Number: GRM319R61E106KA12D; Supplier 1: Digi-Key; Supplier Part Number 1: 490-5525-1-ND
D3-D8 = RL207-TP: DIODE GEN PURP 1KV 2A DO15; Manufacturer: Micro Commercial Co.; Voltage - Forward (Vf) (Max) @ If: 1V @ 2A; Voltage - DC Reverse (Vr) (Max): 1000V; Manufacturer Part Number: RL207-TP; Supplier 1: Digi-Key; Supplier Part Number 1: RL207-TPCT-ND; Current - Average Rectified (Io): 2A
D11 D12 = LTST-C190KGKT: as D9 on sheet SSR; Manufacturer Part Number: LTST-C190KGKT; Supplier 1: Digi-Key; Supplier Part Number 1: 160-1435-1-ND
R39 R40 = RC0603FR-072KL: as R37 on sheet SSR; Manufacturer Part Number: RC0603FR-072KL; Supplier 1: Digi-Key; Supplier Part Number 1: 311-2.00KHRCT-ND
U8 = PSK-10B-S5: AC/DC CONVERTER 120V-5V 10W; Manufacturer: CUI Inc.; Supplier 1: Digi-Key; Supplier Part Number 1: 102-4152-ND; Manufacturer Part Number: PSK-10B-S5
U9 = PSK-10B-S12: AC/DC CONVERTER 120V-12V 10W; Manufacturer: CUI Inc.; Supplier 1: Digi-Key; Supplier Part Number 1: 102-4153-ND; Manufacturer Part Number: PSK-10B-S12
U15 = P78A05-1000: DC/DC CONVERTER 5V 5W; Manufacturer: CUI Inc.; Supplier 1: Digi-Key; Supplier Part Number 1: 102-3781-ND; Manufacturer Part Number: P78A05-1000

## Nets that join several sheets
+5V: TopLevel (8 pins), U_MidLevel/PV1 (C25_PV1.1 C26_PV1.1 U13_PV1.10 U14_PV1.10), U_MidLevel/B1 (C25_B1.1 C26_B1.1 U13_B1.10 U14_B1.10), U_MidLevel/LD1 (C25_LD1.1 C26_LD1.1 U13_LD1.10 U14_LD1.10), U_MidLevel/G1 (C25_G1.1 C26_G1.1 U13_G1.10 U14_G1.10), U_MidLevel/LD2 (JP3_LD2.1 JP4_LD2.1), U_MidLevel/PV2 (JP3_PV2.1 JP4_PV2.1), U_MidLevel/B2 (JP3_B2.1 JP4_B2.1), U_MidLevel/G2 (JP3_G2.1 JP4_G2.1), PLCfilters (D1.2 R1.2 R19.2), PLC (12 pins), PowerCircuit (C36.2 D12.1 I4.1 U15.3)
+5V_N: TopLevel (5 pins), U_MidLevel/LD2 (C22_LD2.2 C23_LD2.2 U10_LD2.2 U12_LD2.2), U_MidLevel/PV2 (C22_PV2.2 C23_PV2.2 U10_PV2.2 U12_PV2.2), U_MidLevel/B2 (C22_B2.2 C23_B2.2 U10_B2.2 U12_B2.2), U_MidLevel/G2 (C22_G2.2 C23_G2.2 U10_G2.2 U12_G2.2), U_MidLevel/PV3 (R25_PV3.2 R28_PV3.2), U_MidLevel/G3 (R25_G3.2 R28_G3.2), U_MidLevel/B3 (R25_B3.2 R28_B3.2), U_MidLevel/LD3 (R25_LD3.2 R28_LD3.2), PowerCircuit (C19.2 U8.3)
+12V: PLCfilters (8 pins), PowerCircuit (6 pins)
GND: TopLevel (6 pins), U_MidLevel/PV1 (C25_PV1.2 C26_PV1.2 U13_PV1.15 U14_PV1.15), U_MidLevel/B1 (C25_B1.2 C26_B1.2 U13_B1.15 U14_B1.15), U_MidLevel/LD1 (C25_LD1.2 C26_LD1.2 U13_LD1.15 U14_LD1.15), U_MidLevel/G1 (C25_G1.2 C26_G1.2 U13_G1.15 U14_G1.15), U_MidLevel/LD2 (Q8_LD2.2 Q9_LD2.2), U_MidLevel/PV2 (Q8_PV2.2 Q9_PV2.2), U_MidLevel/B2 (Q8_B2.2 Q9_B2.2), U_MidLevel/G2 (Q8_G2.2 Q9_G2.2), PLCfilters (21 pins), PLC (11 pins), PowerCircuit (10 pins)
L1_BAT: MidLevel (F5.2), U_MidLevel/B2 (Q4_B2.2), U_MidLevel/B3 (R22_B3.2), PowerCircuit (D7.1)
L1_GRID: MidLevel (F2.1), U_MidLevel/G2 (Q4_G2.2), U_MidLevel/G3 (R22_G3.2), PowerCircuit (D3.1)
L1_PV: MidLevel (F1.2), U_MidLevel/PV2 (Q4_PV2.2), U_MidLevel/PV3 (R22_PV3.2), PowerCircuit (D5.1)
L2_BAT: MidLevel (F7.2), U_MidLevel/B2 (Q6_B2.2), U_MidLevel/B3 (R31_B3.2), PowerCircuit (D8.1)
L2_GRID: MidLevel (F4.1), U_MidLevel/G2 (Q6_G2.2), U_MidLevel/G3 (R31_G3.2), PowerCircuit (D4.1)
L2_PV: MidLevel (F3.2), U_MidLevel/PV2 (Q6_PV2.2), U_MidLevel/PV3 (R31_PV3.2), PowerCircuit (D6.1)
NEUTRAL: TopLevel (7 pins), MidLevel (J4.1 J5.1 J10.1 J11.1), U_MidLevel/LD2 (C22_LD2.1 C23_LD2.1 U10_LD2.1 U12_LD2.1), U_MidLevel/PV2 (C22_PV2.1 C23_PV2.1 U10_PV2.1 U12_PV2.1), U_MidLevel/B2 (C22_B2.1 C23_B2.1 U10_B2.1 U12_B2.1), U_MidLevel/G2 (C22_G2.1 C23_G2.1 U10_G2.1 U12_G2.1), U_MidLevel/PV3 (C27_PV3.1 C30_PV3.2 R26_PV3.1 R27_PV3.1), U_MidLevel/G3 (C27_G3.1 C30_G3.2 R26_G3.1 R27_G3.1), U_MidLevel/B3 (C27_B3.1 C30_B3.2 R26_B3.1 R27_B3.1), U_MidLevel/LD3 (C27_LD3.1 C30_LD3.2 R26_LD3.1 R27_LD3.1), PLCfilters (T1.5), PowerCircuit (8 pins)
I1_BAT: TopLevel (U3.7), U_MidLevel/B1 (I1_B1.1 U13_B1.12)
I1_GD: TopLevel (U3.6), U_MidLevel/G1 (I1_G1.1 U13_G1.12)
I1_LD: TopLevel (U3.5), U_MidLevel/LD1 (I1_LD1.1 U13_LD1.12)
I1_PV: TopLevel (U3.8), U_MidLevel/PV1 (I1_PV1.1 U13_PV1.12)
I2_BAT: TopLevel (U3.3), U_MidLevel/B1 (I2_B1.1 U14_B1.12)
I2_GD: TopLevel (U3.2), U_MidLevel/G1 (I2_G1.1 U14_G1.12)
I2_LD: TopLevel (U3.1), U_MidLevel/LD1 (I2_LD1.1 U14_LD1.12)
I2_PV: TopLevel (U3.4), U_MidLevel/PV1 (I2_PV1.1 U14_PV1.12)
L1_BO: U_MidLevel/B1 (U13_B1.1 U13_B1.2 U13_B1.3 U13_B1.4), U_MidLevel/B2 (Q5_B2.2)
L1_BUS: U_MidLevel/PV1 (U13_PV1.5 U13_PV1.6 U13_PV1.7 U13_PV1.8), U_MidLevel/B1 (U13_B1.5 U13_B1.6 U13_B1.7 U13_B1.8), U_MidLevel/LD1 (U13_LD1.5 U13_LD1.6 U13_LD1.7 U13_LD1.8), U_MidLevel/G1 (U13_G1.5 U13_G1.6 U13_G1.7 U13_G1.8), PLCfilters (C3.1)
L1_GDO: U_MidLevel/G1 (U13_G1.1 U13_G1.2 U13_G1.3 U13_G1.4), U_MidLevel/G2 (Q5_G2.2)
L1_LD: MidLevel (F6.1), U_MidLevel/LD2 (Q4_LD2.2), U_MidLevel/LD3 (R22_LD3.2)
L1_LO: U_MidLevel/LD1 (U13_LD1.1 U13_LD1.2 U13_LD1.3 U13_LD1.4), U_MidLevel/LD2 (Q5_LD2.2)
L1_PVO: U_MidLevel/PV1 (U13_PV1.1 U13_PV1.2 U13_PV1.3 U13_PV1.4), U_MidLevel/PV2 (Q5_PV2.2)
L2_BO: U_MidLevel/B1 (U14_B1.1 U14_B1.2 U14_B1.3 U14_B1.4), U_MidLevel/B2 (Q7_B2.2)
L2_BUS: U_MidLevel/PV1 (U14_PV1.5 U14_PV1.6 U14_PV1.7 U14_PV1.8), U_MidLevel/B1 (U14_B1.5 U14_B1.6 U14_B1.7 U14_B1.8), U_MidLevel/LD1 (U14_LD1.5 U14_LD1.6 U14_LD1.7 U14_LD1.8), U_MidLevel/G1 (U14_G1.5 U14_G1.6 U14_G1.7 U14_G1.8)
L2_GDO: U_MidLevel/G1 (U14_G1.1 U14_G1.2 U14_G1.3 U14_G1.4), U_MidLevel/G2 (Q7_G2.2)
L2_LD: MidLevel (F8.1), U_MidLevel/LD2 (Q6_LD2.2), U_MidLevel/LD3 (R31_LD3.2)
L2_LO: U_MidLevel/LD1 (U14_LD1.1 U14_LD1.2 U14_LD1.3 U14_LD1.4), U_MidLevel/LD2 (Q7_LD2.2)
L2_PVO: U_MidLevel/PV1 (U14_PV1.1 U14_PV1.2 U14_PV1.3 U14_PV1.4), U_MidLevel/PV2 (Q7_PV2.2)
RX: PLCfilters (C2.2 D1.3 R1.1 R3.2), PLC (U4.27)
SCL: TopLevel (I9.1 R33.1 U2.6 U3.14), PLC (J14.4 U4.10)
SDA: TopLevel (I8.1 R32.1 U2.7 U3.15), PLC (J14.5 U4.11)
SW_BAT: U_MidLevel/B2 (Q8_B2.1 Q9_B2.1), PLC (P2.3 U4.7)
SW_GD: U_MidLevel/G2 (Q8_G2.1 Q9_G2.1), PLC (P2.4 U4.8)
SW_LD: U_MidLevel/LD2 (Q8_LD2.1 Q9_LD2.1), PLC (P1.2 U4.16)
SW_PV: U_MidLevel/PV2 (Q8_PV2.1 Q9_PV2.1), PLC (P2.2 U4.6)
TX: PLCfilters (R11.1), PLC (U4.3)
TXDISABLE: PLCfilters (R19.1 R20.2), PLC (U4.5)
V1_BAT: TopLevel (U1.7), U_MidLevel/B3 (C27_B3.2 R24_B3.1 R25_B3.1 R26_B3.2)
V1_GD: TopLevel (U1.6), U_MidLevel/G3 (C27_G3.2 R24_G3.1 R25_G3.1 R26_G3.2)
V1_LD: TopLevel (U1.5), U_MidLevel/LD3 (C27_LD3.2 R24_LD3.1 R25_LD3.1 R26_LD3.2)
V1_PV: TopLevel (U1.8), U_MidLevel/PV3 (C27_PV3.2 R24_PV3.1 R25_PV3.1 R26_PV3.2)
V2_BAT: TopLevel (U1.3), U_MidLevel/B3 (C30_B3.1 R27_B3.2 R28_B3.1 R29_B3.1)
V2_GD: TopLevel (U1.2), U_MidLevel/G3 (C30_G3.1 R27_G3.2 R28_G3.1 R29_G3.1)
V2_LD: TopLevel (U1.1), U_MidLevel/LD3 (C30_LD3.1 R27_LD3.2 R28_LD3.1 R29_LD3.1)
V2_PV: TopLevel (U1.4), U_MidLevel/PV3 (C30_PV3.1 R27_PV3.2 R28_PV3.1 R29_PV3.1)